# Altium project LightLink_V3.PrjPcb (part 1 of 2)
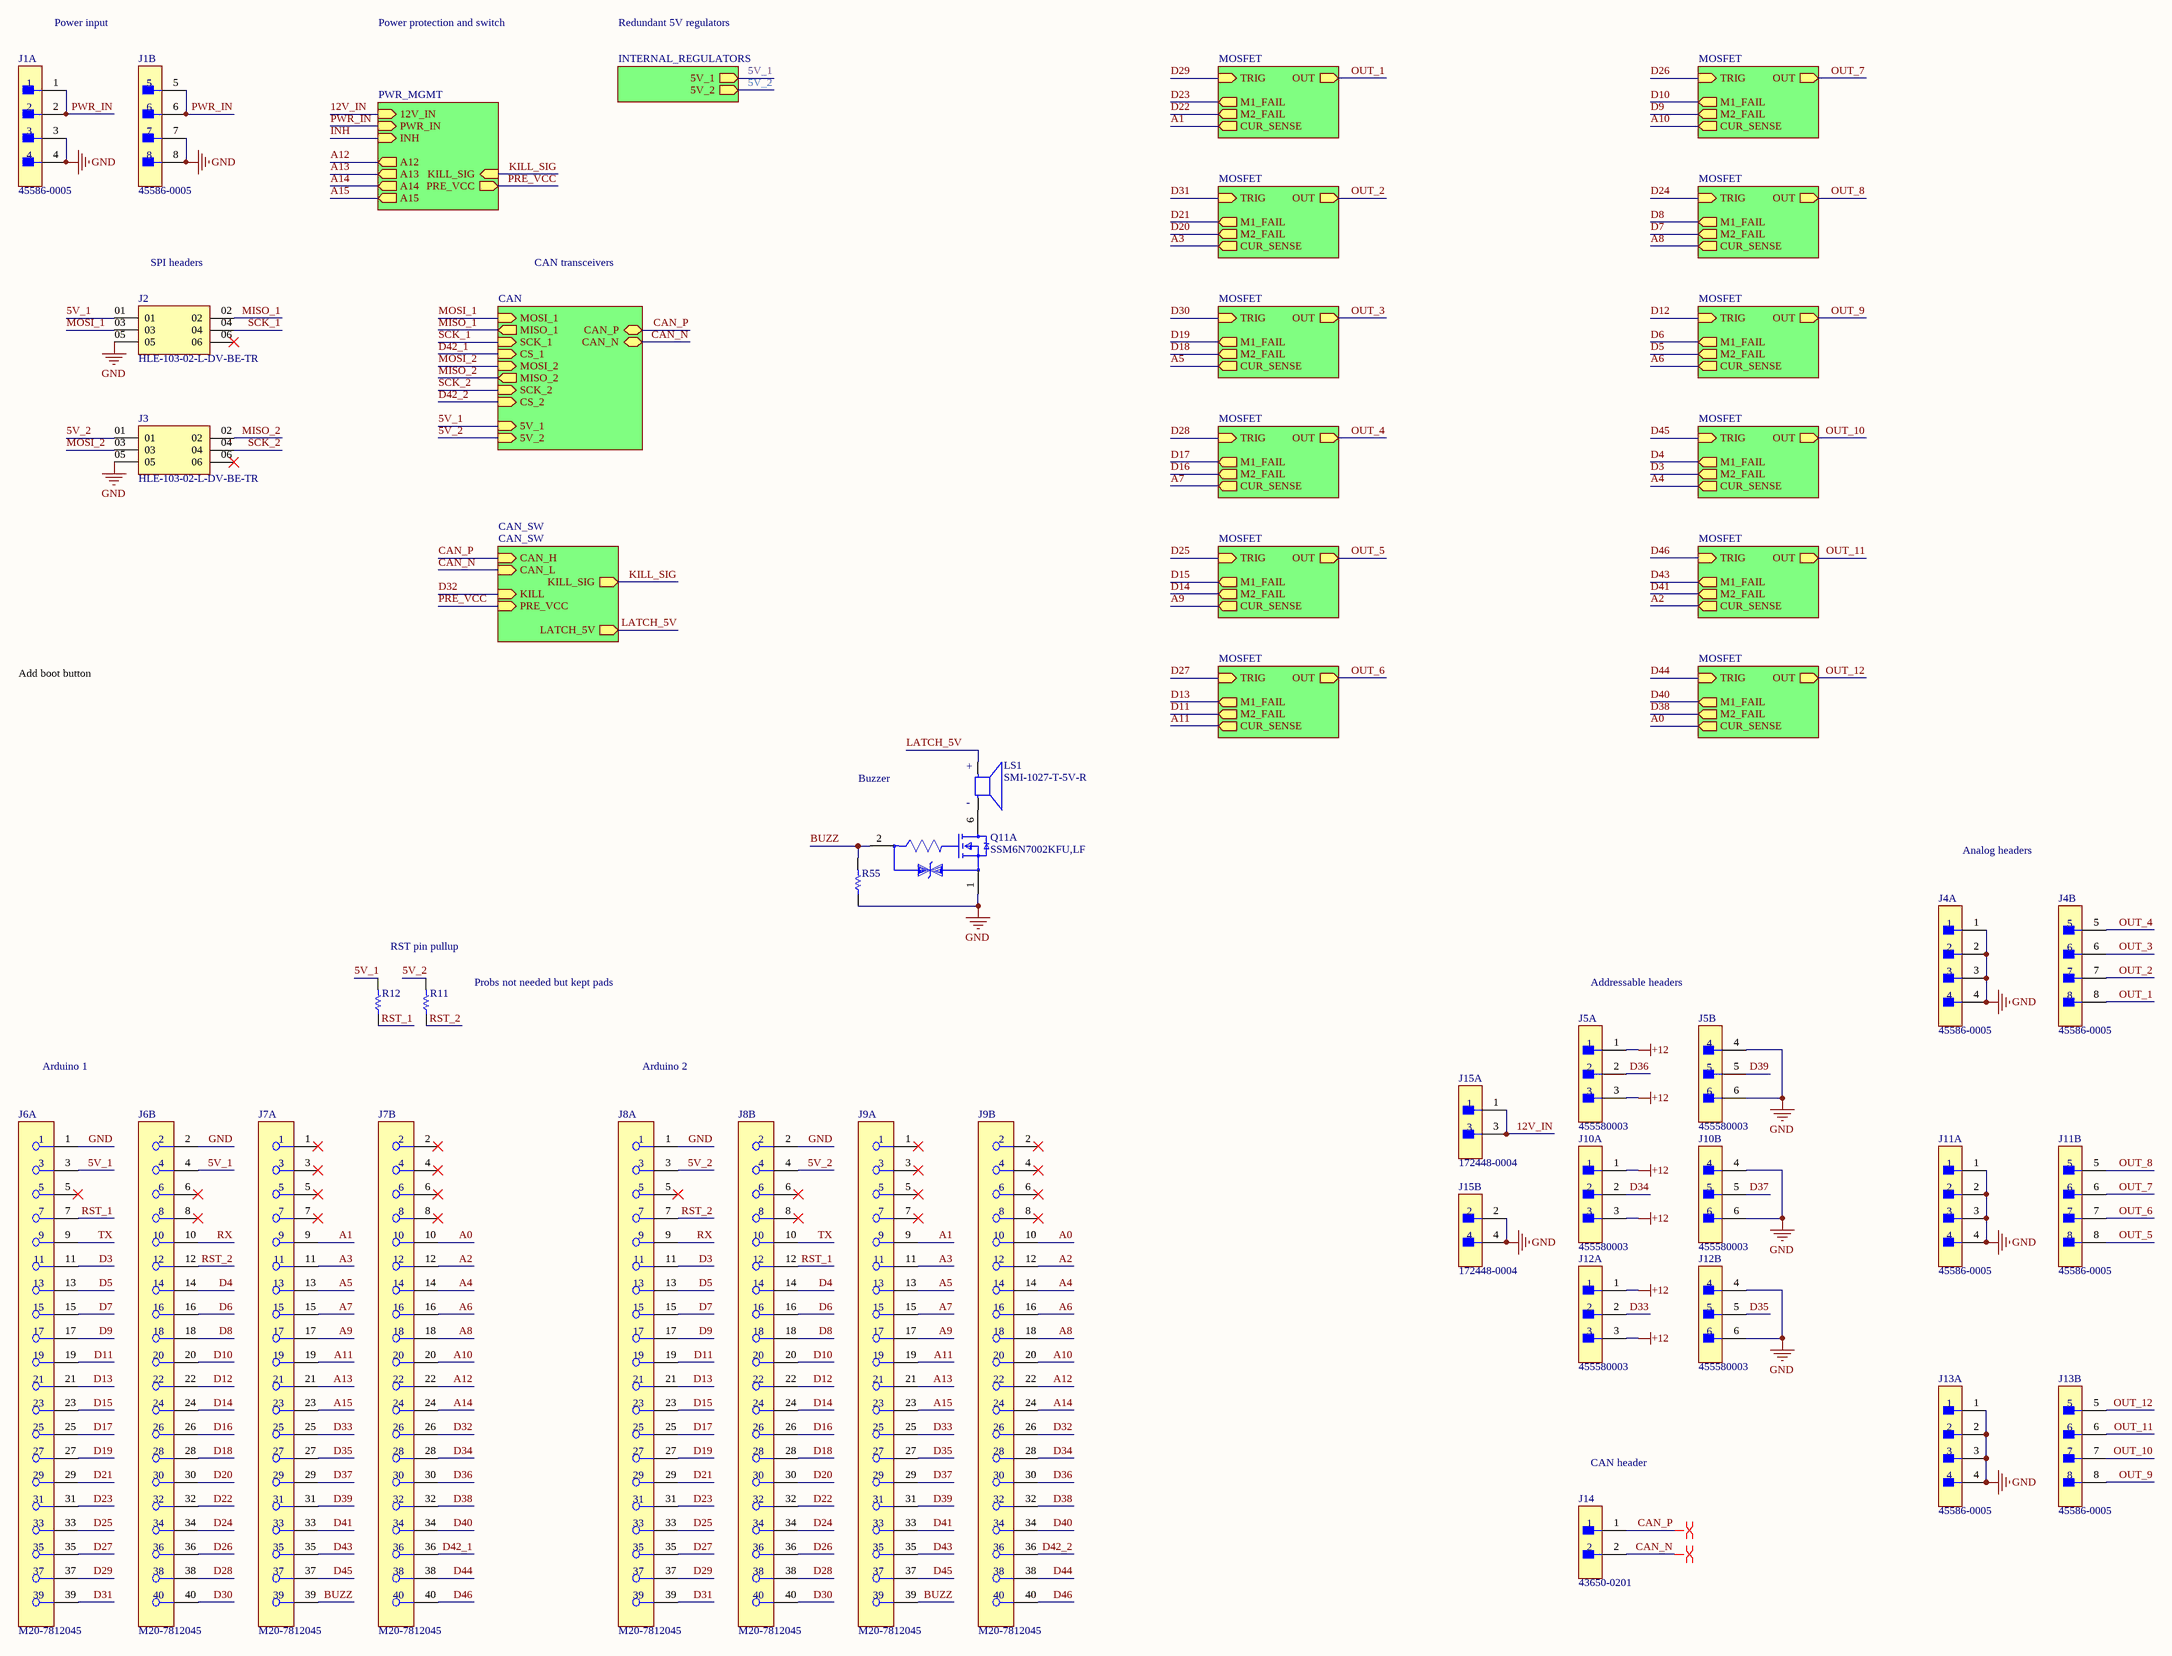
[diagram p0: LightLink_V3.SchDoc]
6 sheets, 429 parts. Net scope: hierarchical (ports join the sheet entries above them; power ports are global).
Board file: LightLink_V3.PcbDoc
Sheets:
  LightLink_V3.SchDoc
    M = MOSFET.SchDoc
    M = MOSFET.SchDoc
    M = MOSFET.SchDoc
    M = MOSFET.SchDoc
    M = MOSFET.SchDoc
    M = MOSFET.SchDoc
    M = MOSFET.SchDoc
    M = MOSFET.SchDoc
    M = MOSFET.SchDoc
    M = MOSFET.SchDoc
    M = MOSFET.SchDoc
    M = MOSFET.SchDoc
    CAN = CAN.SchDoc
    PWR_MGMT = PWR_MGMT.SchDoc
    INTERNAL_REGULATORS = INTERNAL_REGULATORS.SchDoc
    CAN_SW = CAN_SW.SchDoc

## Sheet LightLink_V3.SchDoc
size C; SheetNumber: 1; SheetTotal: 6

### Parts
(Parts that share a designator on the sheet are numbered #1, #2 ... from top to bottom, then left to right.)
J1  45586-0005  [FP-45586-0005-MFG]  (parts A,B of 2)
J2  HLE-103-02-L-DV-BE-TR  [SAMTEC_HLE-103-02-L-DV-BE-TR]
J3  HLE-103-02-L-DV-BE-TR  [SAMTEC_HLE-103-02-L-DV-BE-TR]
J4  45586-0005  [FP-45586-0005-MFG]  (parts A,B of 2)
J5  455580003  [FP-455580003-MFG]  (parts A,B of 2)
J6  M20-7812045  [FP-M20-7812045-MFG]  (parts A,B of 2)
J7  M20-7812045  [FP-M20-7812045-MFG]  (parts A,B of 2)
J8  M20-7812045  [FP-M20-7812045-MFG]  (parts A,B of 2)
J9  M20-7812045  [FP-M20-7812045-MFG]  (parts A,B of 2)
J10  455580003  [FP-455580003-MFG]  (parts A,B of 2)
J11  45586-0005  [FP-45586-0005-MFG]  (parts A,B of 2)
J12  455580003  [FP-455580003-MFG]  (parts A,B of 2)
J13  45586-0005  [FP-45586-0005-MFG]  (parts A,B of 2)
J14  43650-0201  [FP-43650-0201-MFG]
J15  172448-0004  [FP-39-30-1041-MFG]  (parts A,B of 2)
LS1  SMI-1027-T-5V-R  [SMI-1027-T-5V-R-Footprint-1]
Q11#1  SSM6N7002KFU,LF  [FP-SSOP6-P-0_65A-MFG]  (part A of 2)
R11  ERJ3EKF1002V  [RESC1609X55X30LL15T15]  (value not drawn)
R12  ERJ3EKF1002V  [RESC1609X55X30LL15T15]  (value not drawn)
R55  ERJ3EKF1002V  [RESC1609X55X30LL15T15]  (value not drawn)

### Sub-sheets
CAN = CAN: CAN_P (bidir), CAN_N (bidir), CS_1 (in), CS_2 (in), MOSI_1 (in), MISO_1 (out), SCK_1 (in), MOSI_2 (in), MISO_2 (out), SCK_2 (in), 5V_1 (in), 5V_2 (in)
CAN_SW = CAN_SW: CAN_H (in), CAN_L (in), KILL (in), KILL_SIG (out), PRE_VCC (in), LATCH_5V (out)
INTERNAL_REGULATORS = INTERNAL_REGULATORS: 5V_1 (out), 5V_2 (out)
M = MOSFET: TRIG (in), OUT (out), M2_FAIL (out), M1_FAIL (out), CUR_SENSE (out)
M = MOSFET: TRIG (in), OUT (out), M2_FAIL (out), M1_FAIL (out), CUR_SENSE (out)
M = MOSFET: TRIG (in), OUT (out), M2_FAIL (out), M1_FAIL (out), CUR_SENSE (out)
M = MOSFET: TRIG (in), OUT (out), M2_FAIL (out), M1_FAIL (out), CUR_SENSE (out)
M = MOSFET: TRIG (in), OUT (out), M2_FAIL (out), M1_FAIL (out), CUR_SENSE (out)
M = MOSFET: TRIG (in), OUT (out), M2_FAIL (out), M1_FAIL (out), CUR_SENSE (out)
M = MOSFET: TRIG (in), OUT (out), M2_FAIL (out), M1_FAIL (out), CUR_SENSE (out)
M = MOSFET: TRIG (in), OUT (out), M2_FAIL (out), M1_FAIL (out), CUR_SENSE (out)
M = MOSFET: TRIG (in), OUT (out), M2_FAIL (out), M1_FAIL (out), CUR_SENSE (out)
M = MOSFET: TRIG (in), OUT (out), M2_FAIL (out), M1_FAIL (out), CUR_SENSE (out)
M = MOSFET: TRIG (in), OUT (out), M2_FAIL (out), M1_FAIL (out), CUR_SENSE (out)
M = MOSFET: TRIG (in), OUT (out), M2_FAIL (out), M1_FAIL (out), CUR_SENSE (out)
PWR_MGMT = PWR_MGMT: PWR_IN (in), INH (in), A13 (out), A12 (out), PRE_VCC (out), KILL_SIG (in), A14 (out), A15 (out), 12V_IN (in)

### Nets
+12: J5.1 J5.3 J10.1 J10.3 J12.1 J12.3
GND: J1.3 J1.4 J1.7 J1.8 J2.05 J3.05 J4.1 J4.2 J4.3 J4.4 J5.4 J5.6 J6.1 J6.2 J8.1 J8.2 J10.4 J10.6 J11.1 J11.2 J11.3 J11.4 J12.4 J12.6 J13.1 J13.2 J13.3 J13.4 J15.2 J15.4 Q11#1.1(Source1) R55.1
5V_1: J2.01 J6.3 J6.4 R12.2 ; sheet CAN/5V_1, sheet INTERNAL_REGULATORS/5V_1
5V_2: J3.01 J8.3 J8.4 R11.2 ; sheet CAN/5V_2, sheet INTERNAL_REGULATORS/5V_2
12V_IN: J15.1 J15.3 ; sheet PWR_MGMT/12V_IN
A0: J7.10 J9.10 ; sheet M/CUR_SENSE
A1: J7.9 J9.9 ; sheet M/CUR_SENSE
A2: J7.12 J9.12 ; sheet M/CUR_SENSE
A3: J7.11 J9.11 ; sheet M/CUR_SENSE
A4: J7.14 J9.14 ; sheet M/CUR_SENSE
A5: J7.13 J9.13 ; sheet M/CUR_SENSE
A6: J7.16 J9.16 ; sheet M/CUR_SENSE
A7: J7.15 J9.15 ; sheet M/CUR_SENSE
A8: J7.18 J9.18 ; sheet M/CUR_SENSE
A9: J7.17 J9.17 ; sheet M/CUR_SENSE
A10: J7.20 J9.20 ; sheet M/CUR_SENSE
A11: J7.19 J9.19 ; sheet M/CUR_SENSE
A12: J7.22 J9.22 ; sheet PWR_MGMT/A12
A13: J7.21 J9.21 ; sheet PWR_MGMT/A13
A14: J7.24 J9.24 ; sheet PWR_MGMT/A14
A15: J7.23 J9.23 ; sheet PWR_MGMT/A15
BUZZ: J7.39 J9.39 Q11#1.2(Gate1) R55.2
CAN_N: J14.2 ; sheet CAN/CAN_N, sheet CAN_SW/CAN_L
CAN_P: J14.1 ; sheet CAN/CAN_P, sheet CAN_SW/CAN_H
D3: J6.11 J8.11 ; sheet M/M2_FAIL
D4: J6.14 J8.14 ; sheet M/M1_FAIL
D5: J6.13 J8.13 ; sheet M/M2_FAIL
D6: J6.16 J8.16 ; sheet M/M1_FAIL
D7: J6.15 J8.15 ; sheet M/M2_FAIL
D8: J6.18 J8.18 ; sheet M/M1_FAIL
D9: J6.17 J8.17 ; sheet M/M2_FAIL
D10: J6.20 J8.20 ; sheet M/M1_FAIL
D11: J6.19 J8.19 ; sheet M/M2_FAIL
D12: J6.22 J8.22 ; sheet M/TRIG
D13: J6.21 J8.21 ; sheet M/M1_FAIL
D14: J6.24 J8.24 ; sheet M/M2_FAIL
D15: J6.23 J8.23 ; sheet M/M1_FAIL
D16: J6.26 J8.26 ; sheet M/M2_FAIL
D17: J6.25 J8.25 ; sheet M/M1_FAIL
D18: J6.28 J8.28 ; sheet M/M2_FAIL
D19: J6.27 J8.27 ; sheet M/M1_FAIL
D20: J6.30 J8.30 ; sheet M/M2_FAIL
D21: J6.29 J8.29 ; sheet M/M1_FAIL
D22: J6.32 J8.32 ; sheet M/M2_FAIL
D23: J6.31 J8.31 ; sheet M/M1_FAIL
D24: J6.34 J8.34 ; sheet M/TRIG
D25: J6.33 J8.33 ; sheet M/TRIG
D26: J6.36 J8.36 ; sheet M/TRIG
D27: J6.35 J8.35 ; sheet M/TRIG
D28: J6.38 J8.38 ; sheet M/TRIG
D29: J6.37 J8.37 ; sheet M/TRIG
D30: J6.40 J8.40 ; sheet M/TRIG
D31: J6.39 J8.39 ; sheet M/TRIG
D32: J7.26 J9.26 ; sheet CAN_SW/KILL
D33: J7.25 J9.25 J12.2
D34: J7.28 J9.28 J10.2
D35: J7.27 J9.27 J12.5
D36: J5.2 J7.30 J9.30
D37: J7.29 J9.29 J10.5
D38: J7.32 J9.32 ; sheet M/M2_FAIL
D39: J5.5 J7.31 J9.31
D40: J7.34 J9.34 ; sheet M/M1_FAIL
D41: J7.33 J9.33 ; sheet M/M2_FAIL
D42_1: J7.36 ; sheet CAN/CS_1  [project net CS_1]
D42_2: J9.36 ; sheet CAN/CS_2  [project net CS_2]
D43: J7.35 J9.35 ; sheet M/M1_FAIL
D44: J7.38 J9.38 ; sheet M/TRIG
D45: J7.37 J9.37 ; sheet M/TRIG
D46: J7.40 J9.40 ; sheet M/TRIG
INH: sheet PWR_MGMT/INH
KILL_SIG: sheet PWR_MGMT/KILL_SIG, sheet CAN_SW/KILL_SIG
LATCH_5V: LS1.LOAD+(POS) ; sheet CAN_SW/LATCH_5V
MISO_1: J2.02 ; sheet CAN/MISO_1
MISO_2: J3.02 ; sheet CAN/MISO_2
MOSI_1: J2.03 ; sheet CAN/MOSI_1
MOSI_2: J3.03 ; sheet CAN/MOSI_2
OUT_1: J4.8 ; sheet M/OUT
OUT_2: J4.7 ; sheet M/OUT
OUT_3: J4.6 ; sheet M/OUT
OUT_4: J4.5 ; sheet M/OUT
OUT_5: J11.8 ; sheet M/OUT
OUT_6: J11.7 ; sheet M/OUT
OUT_7: J11.6 ; sheet M/OUT
OUT_8: J11.5 ; sheet M/OUT
OUT_9: J13.8 ; sheet M/OUT
OUT_10: J13.7 ; sheet M/OUT
OUT_11: J13.6 ; sheet M/OUT
OUT_12: J13.5 ; sheet M/OUT
PRE_VCC: sheet PWR_MGMT/PRE_VCC, sheet CAN_SW/PRE_VCC
PWR_IN: J1.1 J1.2 J1.5 J1.6 ; sheet PWR_MGMT/PWR_IN
RST_1: J6.7 J8.12 R12.1
RST_2: J6.12 J8.7 R11.1
RX: J6.10 J8.9
SCK_1: J2.04 ; sheet CAN/SCK_1
SCK_2: J3.04 ; sheet CAN/SCK_2
TX: J6.9 J8.10
NetLS1_LOAD-: LS1.LOAD-(NEG) Q11#1.6(Drain1)

Not connected (* = marked no-connect by the designer): J2 06*; J3 06*; J6 5* 6* 8*; J7 1* 2* 3* 4* 5* 6* 7* 8*; J8 5* 6* 8*; J9 1* 2* 3* 4* 5* 6* 7* 8*

### Layout directives
differential pair: CAN_N, CAN_P

### Notes on the sheet
- Power input
- Power protection and switch
- Redundant 5V regulators
- SPI headers
- CAN transceivers
- Add boot button
- Buzzer
- Analog headers
- RST pin pullup
- Probs not needed but kept pads
- Addressable headers
- Arduino 1
- Arduino 2
- CAN header
- (in symbol CMP-00027-00002-1) +; -

### Library data of the parts
J1 J4 J11 J13 = CMP-04776-000690-1: CONN HEADER R/A 8POS 4.2MM
J2 J3 = CMP-020-000000-4: MF: Samtec; Availability: Unavailable; Package: None; Component Type: Standard; MP: HLE-103-02-L-DV-BE-TR; Pin Count: 6; Design Item ID: HLE-103-02-L-DV-BE-TR; Value: *; Price: None; Source: HLE-103-02-L-DV-BE-TR.SchLib
J5 J10 J12 = CMP-04776-000024-1: CONN HEADER R/A 6POS 4.2MM; Manufacturer: Molex; Standoff Height: 0.4mm; Conn Orientation: Right Angle; Number Of Contacts: 6; Conn Gender: Male; Voltage Rating: 600V; Current Rating: 8A; Footprint Url: https://www.molex.com/pdm_docs/sd/455580003_sd.pdf; Number Of Rows: 2; Lead Free: Yes; Digikey Description: CONN HEADER R/A 6POS 4.2MM; ComponentLink2URL: https://www.molex.com/webdocs/datasheets/pdf/en-us/0455580003_PCB_HEADERS.pdf; Octopart: https://octopart.com/45558-0003-molex-7672845; Package: 0; Device Class L3: unset; ComponentLink2Description: Datasheet; Device Class L2: Headers and Wire Housings; Category: Conn; Contact Material: Tin,Nickel; Mouser Description: Conn Power HDR 6 POS 4.2mm Solder ST Thru-Hole 6 Terminal 1 Port Mini-Fit Jr™ Tray; Manufacturer Part Number: 455580003; Pitch: 4.2mm; Device Class L1: Connectors; Temperature Range Low: -40°C; Temperature: -40°C to +105°C; RoHS: TRUE; Temperature Range High: +105°C; Height: 10.38mm; Automotive: No
J6-J9 = CMP-15831-000026-1: CONN RCPT 40POS 0.1 GOLD SMD; Current Rating: 3A; Number of Positions: 40; Connector Type: Receptacle; Max Operating Temperature: 105°C; Flammability Rating: UL94 V-0; Contact Material: Bronze; Number of Rows: 2; Fastening Type: Push; Insulation Color: Black; Mount: Surface Mount; Contact Shape: Square; Termination: Solder; Packaging: Rail/Tube; Contact Plating: Gold; Min Operating Temperature: -40°C; Insulation Material: Nylon
J14 = CMP-04776-000557-1: CONN HEADER R/A 2POS 3MM; Voltage Rating: 600V; Number of Circuits: 2; Insulation Resistance: 1GR; Current Rating: 5A; Voltage Rating (DC): 250V; Contact Resistance: 10mR; Gender: Male; Number of Ports: 1; Glow Wire Compliant: Compliant; Pitch: 3mm; Contact Plating: Gold; Series: 43650; Color: Black; Max Operating Temperature: 105°C; Radiation Hardening: No; Orientation: Right Angle; Number of Terminals/Pins: 2; Length: 9.65mm; Case/Package: 0201; Halogen Free: Low Halogen; Housing Color: Black; Min Operating Temperature: -40°C; Package Quantity: 3927; Contact Material: Brass; Number of Rows: 1; Number of Positions: 2; Termination: Solder; Depth: 9.9mm; Mount: Through Hole; Packaging: Tray; Number of Contacts: 2; Housing Material: Thermoplastic; Flammability Rating: UL94 V-0
J15 = CMP-04776-000047-1: Different component but holes should line up. Original P/N is 39-30-1041; Manufacturer: Molex; Old_Part_Number: 5569-04A2G; Keying_to_Mating_Part: None; Circuits_maximum: 4; First_Mate__Last_Break: No; Lead_freeProcess_Capability: WAVE; Duration_at_Max_Process_Temperature_seconds: 005; Sales_Drawing: SDA-5569-NA2*-*; Current Rating: 13A; Material___Plating_Mating: Gold; Conn Gender: Male; Test_Summary: TS-5556-002; Color___Resin: Natural; Termination_Interface_Style: Through Hole; Pitch___Termination_Interface: 4.20mm; UL: E29179; PCB_Retention: Yes; Product_Name: Mini-Fit Jr.TM; Material___Resin: Nylon; Overview: Mini-Fit Jr. Power Connectors; CSA: LR19980; Plating_min___Termination: 2.540μm; Packaging_Type: Bag; Number_of_Rows: 2; Durability_mating_cycles_max: 30; Max_Cycles_at_Max_Process_Temperature: 001; Product_Specification: PS-45750-001, PS-5556-001; Net_Weight: 1.529/g; Voltage___Maximum: 600V; Material___Metal: Brass; Pitch: 4.2mm; Packaging_Specification: PK-5569-002; Shrouded: Fully; Plating_min___Mating: 0.762μm; Temperature_Range___Operating: -40°C to +105°C; Current___Maximum_per_Contact: 13.0A; Comments: Current = 13A max. per circuit when header is mated to a receptacle loaded with  45750  Mini-Fit® Plus HCS Crimp Terminal Crimped to 16 AWG wire.,  See Molex Product specification PS-5556-001 for additional current de-rating information.; Process_Temperature_max_C: 240; PCB_Thickness___Recommended: 1.78mm; Standoff Height: 0.016inch; Surface_Mount_Compatible_SMC: No; UPC: 800753579651; Conn Orientation: Right Angle; Material___Plating_Termination: Matte Tin; ComponentLink2Description: Datasheet; Footprint Url: https://www.molex.com/pdm_docs/sd/039301041_sd.pdf; Contact Material: Gold,Nickel; Octopart: https://octopart.com/39-30-1041-molex-276737; Digikey Description: CONN HEADER R/A 4POS 4.2MM; imported: yes; Series: 5569; Mouser Description: Headers & Wire Housings 4 CKT R/A HEADER; Temperature Range High: +105°C; Category: Conn; Polarized_to_Mating_Part: Yes; Pitch___Mating_Interface: 4.20mm; Automotive: No; Guide_to_Mating_Part: No; Lock_to_Mating_Part: Yes; Number Of Contacts: 4; Temperature Range Low: -40°C; RoHS: TRUE; Status: Active; imported_from: 3D Model; ComponentLink2URL: http://www.molex.com/pdm_docs/sd/039301041_sd.pdf; part_page: http://www.molex.com/molex/products/datasheet.jsp?part=active/0039301041_PCB_HEADERS.xml; Temperature: -40°C to +105°C; Device Class L3: unset; Device Class L1: Connectors; Package: 39-30-1041; Circuits_Loaded: 4; Lead Free: Yes; Ipc Land Pattern Name: CAPAD1016W80L630D240; Application: Power, Wire-to-Board; Voltage Rating: 600V; Manufacturer Part Number: 39-30-1041; Breakaway: No; Orientation: Right Angle; Flammability: 94V-2; 3D_model: http://www.molex.com/pdm_docs/stp/39-30-1041_stp.zip; Number Of Rows: 2; Polarized_to_PCB: Yes; Device Class L2: Headers and Wire Housings; Glow_Wire_Compliant: No; Stackable: No; PCB_Locator: Yes
LS1 = CMP-00027-00002-1: Audio Ind Magnt 5V 9.6X9.6MM SMD
Q11#1 = CMP-35916-000009-1: MOSFET 2N-CH 60V 0.3A; Input Capacitance: 40pF; Continuous Drain Current (ID): 300mA; Max Power Dissipation: 285mW; FET Type: 2 N-Channel; Rds On Max: 1.5R; Mount: Surface Mount; Drain to Source Voltage (Vdss): 60V; Packaging: Tape and Reel
R11 R12 R55 = CMP-1012-00623-3: Chip Resistor, 10 KOhm, +/- 1%, 0.1 W, -55 to 155 degC, 0603 (1608 Metric), RoHS, Tape and Reel; Manufacturer: Panasonic; Voltage Rating: 75V; Case\/Package: 0603; Power Rating: 100mW; Resistance: 10KOhm; Temperature Coefficient: 100ppm\/degreesC; Number of Pins: 2; Package Reference: 603; Depth: 0.8mm; Mount: SurfaceMount; Package Description: 2-Pin Surface Mount Device, Body 1.6 x 0.85 mm; Datasheet Version: 02/2017; Length: 1.6mm; Lead Free: LeadFree; Height: 0.45mm; Number of Terminations: 2; Max Power Dissipation: 100mW; Min Operating Temperature: -55degC; Datasheet URL: https://industrial.panasonic.com/cdbs/www-data/pdf/RDA0000/AOA0000C304.pdf; Termination: SMD/SMT; Case Code (Metric): 1608; Case Code (Imperial): 0603; Tolerance: 1%; Max Operating Temperature: 155degC; RoHSCompliant: true; Voltage Rating (DC): 75V; Radiation Hardening: No; Packaging: TapeandReel; Composition: ThickFilm; Mounting Technology: SurfaceMount; Manufacturer URL: http://www.panasonic.com/; Width: 0.031inch; REACH SVHC: NoSVHC; Contact Plating: Tin; Military Standard: Not; Package Quantity: 1

## Sheet MOSFET.SchDoc
size B; SheetNumber: 2; SheetTotal: 6
Used 12 times, as channels M, M, M, M, M, M, M, M, M, M, M, M. Parts and nets are listed once, with the designators drawn on the sheet.
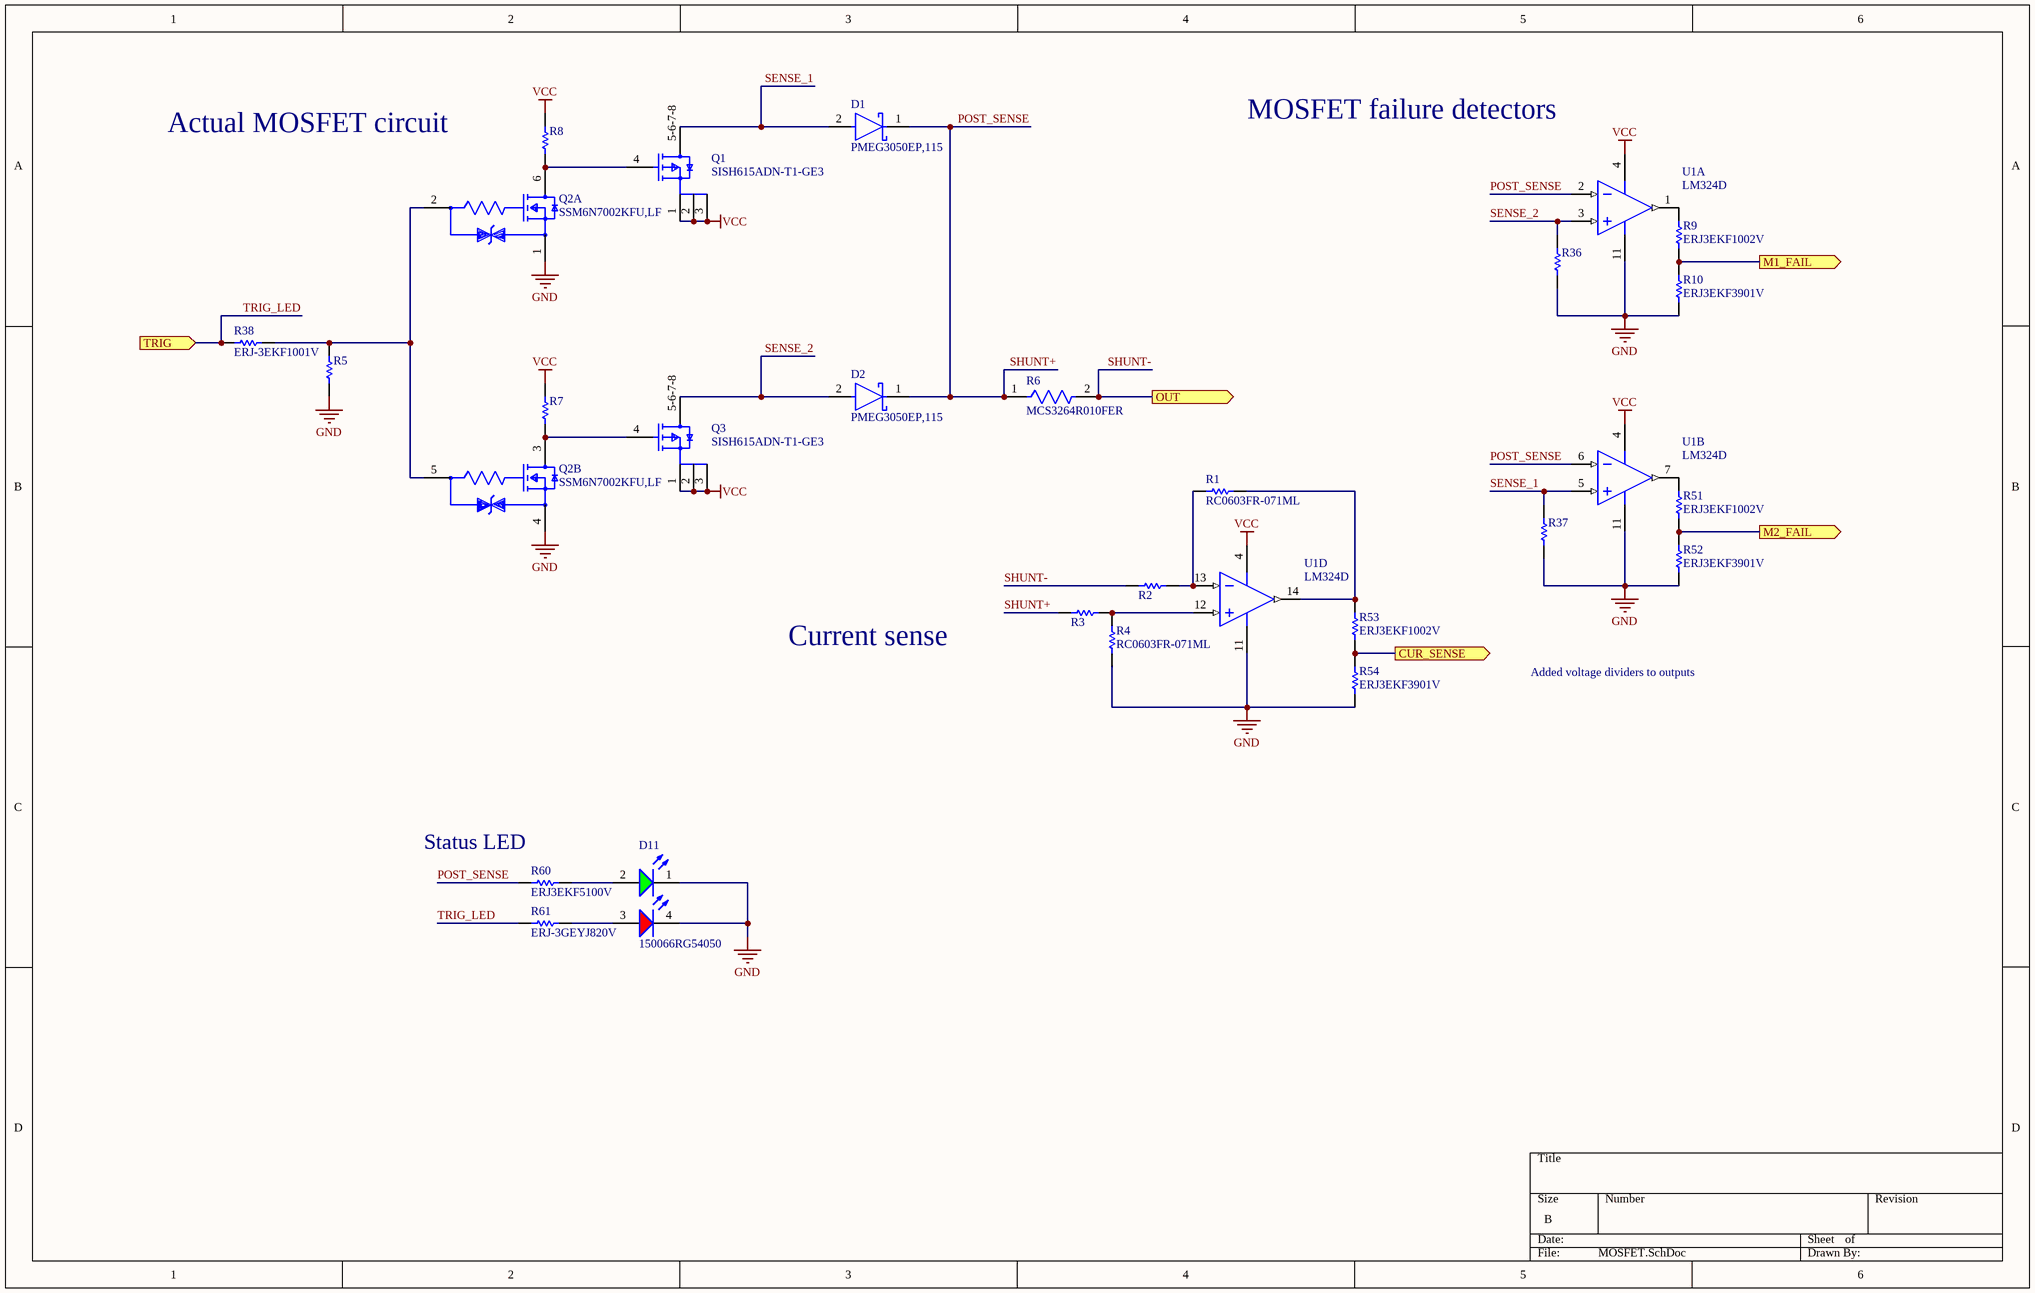
[diagram p1: MOSFET.SchDoc]

### Parts
D1  PMEG3050EP,115  [FP-SOD128-MFG]
D2  PMEG3050EP,115  [FP-SOD128-MFG]
D11  150066RG54050  [WL-SBCD_0606]
Q1  SISH615ADN-T1-GE3  [SISH615ADN-T1-GE3-Footprint-1]
Q2  SSM6N7002KFU,LF  [FP-SSOP6-P-0_65A-MFG]  (parts A,B of 2)
Q3  SISH615ADN-T1-GE3  [SISH615ADN-T1-GE3-Footprint-1]
R1  RC0603FR-071ML  [RESC1608X55X25LL10T15]
R2  ERJ3EKF1002V  [RESC1609X55X30LL15T15]  (value not drawn)
R3  ERJ3EKF1002V  [RESC1609X55X30LL15T15]  (value not drawn)
R4  RC0603FR-071ML  [RESC1608X55X25LL10T15]
R5  ERJ3EKF1002V  [RESC1609X55X30LL15T15]  (value not drawn)
R6  MCS3264R010FER  [FP-MCS3264-MFG]
R7  ERJ3EKF1002V  [RESC1609X55X30LL15T15]  (value not drawn)
R8  ERJ3EKF1002V  [RESC1609X55X30LL15T15]  (value not drawn)
R9  ERJ3EKF1002V  [RESC1609X55X30LL15T15]
R10  ERJ3EKF3901V  [RESC1608X55X30ML15T15]
R36  ERJ-3EKF1003V  [RESC1608X55X30ML15T15]  (value not drawn)
R37  ERJ-3EKF1003V  [RESC1608X55X30ML15T15]  (value not drawn)
R38  ERJ-3EKF1001V  [RESC1608X55X30LL15T15]
R51  ERJ3EKF1002V  [RESC1609X55X30LL15T15]
R52  ERJ3EKF3901V  [RESC1608X55X30ML15T15]
R53  ERJ3EKF1002V  [RESC1609X55X30LL15T15]
R54  ERJ3EKF3901V  [RESC1608X55X30ML15T15]
R60  ERJ3EKF5100V  [RESC1608X55X30NL15T15]
R61  ERJ-3GEYJ820V  [RESC1608X55X30NL15T15]
U1  LM324D  [D0014A_L]  (parts A,B,D of 4)

### Ports
CUR_SENSE (out, see LightLink_V3[5A]), M1_FAIL (out, see LightLink_V3[5A]), M2_FAIL (out, see LightLink_V3[5A]), OUT (out, see LightLink_V3[5A]), TRIG (in, see LightLink_V3[5A])

### Nets
GND: D11.1(K) D11.4(K) Q2.1(Source1) Q2.4(Source2) R4.1 R5.1 R10.1 R36.1 R37.1 R52.1 R54.1 U1.11(GND)
VCC: Q1.1(S) Q1.2(S) Q1.3(S) Q3.1(S) Q3.2(S) Q3.3(S) R7.2 R8.2 U1.4(VCC)
CUR_SENSE: R53.1 R54.2 ; port CUR_SENSE
M1_FAIL: R9.1 R10.2 ; port M1_FAIL
M2_FAIL: R51.1 R52.2 ; port M2_FAIL
POST_SENSE: D1.1(C) D2.1(C) R3.2 R6.1 R60.1 U1.2(1IN-) U1.6(2IN-)  [also labelled SHUNT+]
SENSE_1: D1.2(A) Q1.5-6-7-8(D) R37.2 U1.5(2IN+)
SENSE_2: D2.2(A) Q3.5-6-7-8(D) R36.2 U1.3(1IN+)
SHUNT-: R2.2 R6.2 ; port OUT
TRIG_LED: R38.1 R61.1 ; port TRIG
NetD11_2: D11.2(A) R60.2
NetD11_3: D11.3(A) R61.2
NetQ1_4: Q1.4(G) Q2.6(Drain1) R8.1
NetQ2_2: Q2.2(Gate1) Q2.5(Gate2) R5.2 R38.2
NetQ2_3: Q2.3(Drain2) Q3.4(G) R7.1
NetR1_1: R1.1 R2.1 U1.13(4IN-)
NetR1_2: R1.2 R53.2 U1.14(4OUT)
NetR3_1: R3.1 R4.2 U1.12(4IN+)
NetR9_2: R9.2 U1.1(1OUT)
NetR51_2: R51.2 U1.7(2OUT)

### Channels
M: designators end in _M#1; ports CUR_SENSE=A1 M1_FAIL=D23 M2_FAIL=D22 OUT=OUT_1 TRIG=D29
M: designators end in _M#2; ports CUR_SENSE=A3 M1_FAIL=D21 M2_FAIL=D20 OUT=OUT_2 TRIG=D31
M: designators end in _M#3; ports CUR_SENSE=A5 M1_FAIL=D19 M2_FAIL=D18 OUT=OUT_3 TRIG=D30
M: designators end in _M#4; ports CUR_SENSE=A7 M1_FAIL=D17 M2_FAIL=D16 OUT=OUT_4 TRIG=D28
M: designators end in _M#5; ports CUR_SENSE=A9 M1_FAIL=D15 M2_FAIL=D14 OUT=OUT_5 TRIG=D25
M: designators end in _M#6; ports CUR_SENSE=A11 M1_FAIL=D13 M2_FAIL=D11 OUT=OUT_6 TRIG=D27
M: designators end in _M#7; ports CUR_SENSE=A10 M1_FAIL=D10 M2_FAIL=D9 OUT=OUT_7 TRIG=D26
M: designators end in _M#8; ports CUR_SENSE=A8 M1_FAIL=D8 M2_FAIL=D7 OUT=OUT_8 TRIG=D24
M: designators end in _M#9; ports CUR_SENSE=A6 M1_FAIL=D6 M2_FAIL=D5 OUT=OUT_9 TRIG=D12
M: designators end in _M#10; ports CUR_SENSE=A4 M1_FAIL=D4 M2_FAIL=D3 OUT=OUT_10 TRIG=D45
M: designators end in _M#11; ports CUR_SENSE=A2 M1_FAIL=D43 M2_FAIL=D41 OUT=OUT_11 TRIG=D46
M: designators end in _M#12; ports CUR_SENSE=A0 M1_FAIL=D40 M2_FAIL=D38 OUT=OUT_12 TRIG=D44

### Notes on the sheet
- Actual MOSFET circuit
- MOSFET failure detectors
- Current sense
- Added voltage dividers to outputs
- (near R60) Status LED

### Library data of the parts
D1 D2 = CMP-14398-000051-1: DIODE SCHOTTKY 30V 5A SOD128; RoHS Compliant: Yes
D11 = CMP-004-00034-2: Led, Red/Grn, 180Mcd/230Mcd, 624Nm/525Nm Rohs Compliant: Yes
Q1 Q3 = CMP-013-00036-2: Trans MOSFET P-CH 20V 22.1A 8-Pin PowerPAK 1212 EP T/R
Q2 = CMP-35916-000009-1: as Q11#1 on sheet LightLink_V3; Mount: Surface Mount; Drain to Source Voltage (Vdss): 60V; Packaging: Tape and Reel
R1 R4 = CMP-1659-00056-1: Chip Resistor, 1 MOhm, +/- 1%, 100 mW, -55 to 155 degC, 0603 (1608 Metric), RoHS, Tape and Reel; Voltage Rating (DC): 25 V; Tolerance: 20%; Case\Package: Radial; Capacitance: 1 mF; Min Operating Temperature: -40 degC; PackageDescription: 2-Pin Surface Mount Device, Body 1.6 x 0.8 mm; ComponentLink1Description: Manufacturer URL; Radiation Hardening: No; DatasheetVersion: Rev. 4, 02/2016; REACH SVHC: No SVHC; Length: 20 mm; Max Operating Temperature: 85 degC; Diameter: 10 mm; Packaging: Bulk; Package Quantity: 200; PackageReference: 0603; Mount: Through Hole; ComponentLink1URL: http://www.yageo.com/; ComponentLink2URL: http://www.yageo.com/documents/recent/PYu-RC_Group_51_RoHS_L_04.pdf; ComponentLink2Description: Datasheet; Width: 0 inch; Lead Pitch: 5 mm; RoHSCompliant: true; Voltage Rating: 25 V; Height: 20 mm
R2 R3 R5 R7-R9 R51 R53 = CMP-1012-00623-3: as R11 on sheet LightLink_V3; Number of Pins: 2; Package Reference: 603; Depth: 0.8mm; Mount: SurfaceMount; Package Description: 2-Pin Surface Mount Device, Body 1.6 x 0.85 mm; Datasheet Version: 02/2017; Length: 1.6mm; Lead Free: LeadFree; Height: 0.45mm; Number of Terminations: 2; Max Power Dissipation: 100mW; Min Operating Temperature: -55degC; Datasheet URL: https://industrial.panasonic.com/cdbs/www-data/pdf/RDA0000/AOA0000C304.pdf; Termination: SMD/SMT; Case Code (Metric): 1608; Case Code (Imperial): 0603; Tolerance: 1%; Max Operating Temperature: 155degC; RoHSCompliant: true; Voltage Rating (DC): 75V; Radiation Hardening: No; Packaging: TapeandReel; Composition: ThickFilm; Mounting Technology: SurfaceMount; Manufacturer URL: http://www.panasonic.com/; Width: 0.031inch; REACH SVHC: NoSVHC; Contact Plating: Tin; Military Standard: Not; Package Quantity: 1
R6 = CMP-33361-000012-1: RES SMD 10 MOHM 1% 2W 3264; Temperature Coefficient: 50ppm/°C; Resistance: 10mR; Voltage Rating: 220mV; Case/Package: 2512; Military Standard: Not; Max Operating Temperature: 150°C; Height: 0.024inch; Package Quantity: 1; Case Code (Imperial): 2512; Number of Terminations: 2; Features: Flame Retardant Coating; Width: 0.126inch; Tolerance: 1%; Composition: Metal Element; Number of Pins: 2; Packaging: Tape and Reel; Depth: 3.2mm; Termination: SMD/SMT; Min Operating Temperature: -55°C; Power Rating: 2W; Case Code (Metric): 6432; Max Power Dissipation: 2W; Mount: Surface Mount; Length: 6.4mm
R10 R52 R54 = CMP-2000-00475-1: Manufacturer: Panasonic; Part Number: ERJ3EKF3901V
R36 R37 = CMP-2000-00182-1: Manufacturer: Panasonic; Part Number: ERJ-3EKF1003V
R38 = CMP-2000-00180-1: Manufacturer: Panasonic; Part Number: ERJ-3EKF1001V
R60 = CMP-2000-00539-1: Manufacturer: Panasonic; Part Number: ERJ3EKF5100V
R61 = CMP-1012-00048-2: Manufacturer: Panasonic; Part Number: ERJ-3GEYJ820V
U1 = CMP-2000-06547-1: Quadruple Operational Amplifier, 0.5 V/us, 1.2 MHz, 3 to 32 V, 0 to 70 degC, 14-Pin SOIC (D), Green (RoHS & no Sb/Br), Tube; Manufacturer: Texas Instruments; Unity Gain Bandwidth Product: 1.2MHz; Input Offset Voltage: 7mV; Dual Supply Voltage (Max): ±16V; Single Supply Voltage (Min): 3V; Single Supply Voltage (Max): 32V; Voltage Gain in dB: 100dB; Power Supply Requirement: Single/Dual; Input Bias Current: 250nA; Dual Supply Voltage (Min): ±1.5V; Single Supply Voltage (Typ): 5/9/12/15/18/24/28V; Dual Supply Voltage (Typ): ±3/±5/±9/±12/±15V; Number of  Elements: 4; Common Mode Rejection Ratio: 65dB; Datasheet Version: Rev. W, 03/2015; Technology: Bipolar; Shut Down Feature: No; Package Reference: D0014A; Type: GeneralPurposeAmplifier; Pin Count: 14; Package Type: SOIC; Rail/Rail I/O Type: No; Manufacturer URL: http://www.ti.com/; Package Description: 14-Pin Small Outline Integrated Circuit, Body 8.65 x 3.9 mm, Pitch 1.27 mm; Operating Temperature Classification: Commercial; Datasheet URL: http://www.ti.com/lit/ds/symlink/lm324.pdf; Slew Rate: 0.5V/us; Package URL: http://www.ti.com/lit/ml/mpds177g/mpds177g.pdf; Mounting: SurfaceMount; Packaging: Rail/Tube; Mounting Technology: SurfaceMount; Operating Temp Range: 0Cto70C

## Sheet CAN.SchDoc
size B; SheetNumber: 3; SheetTotal: 6
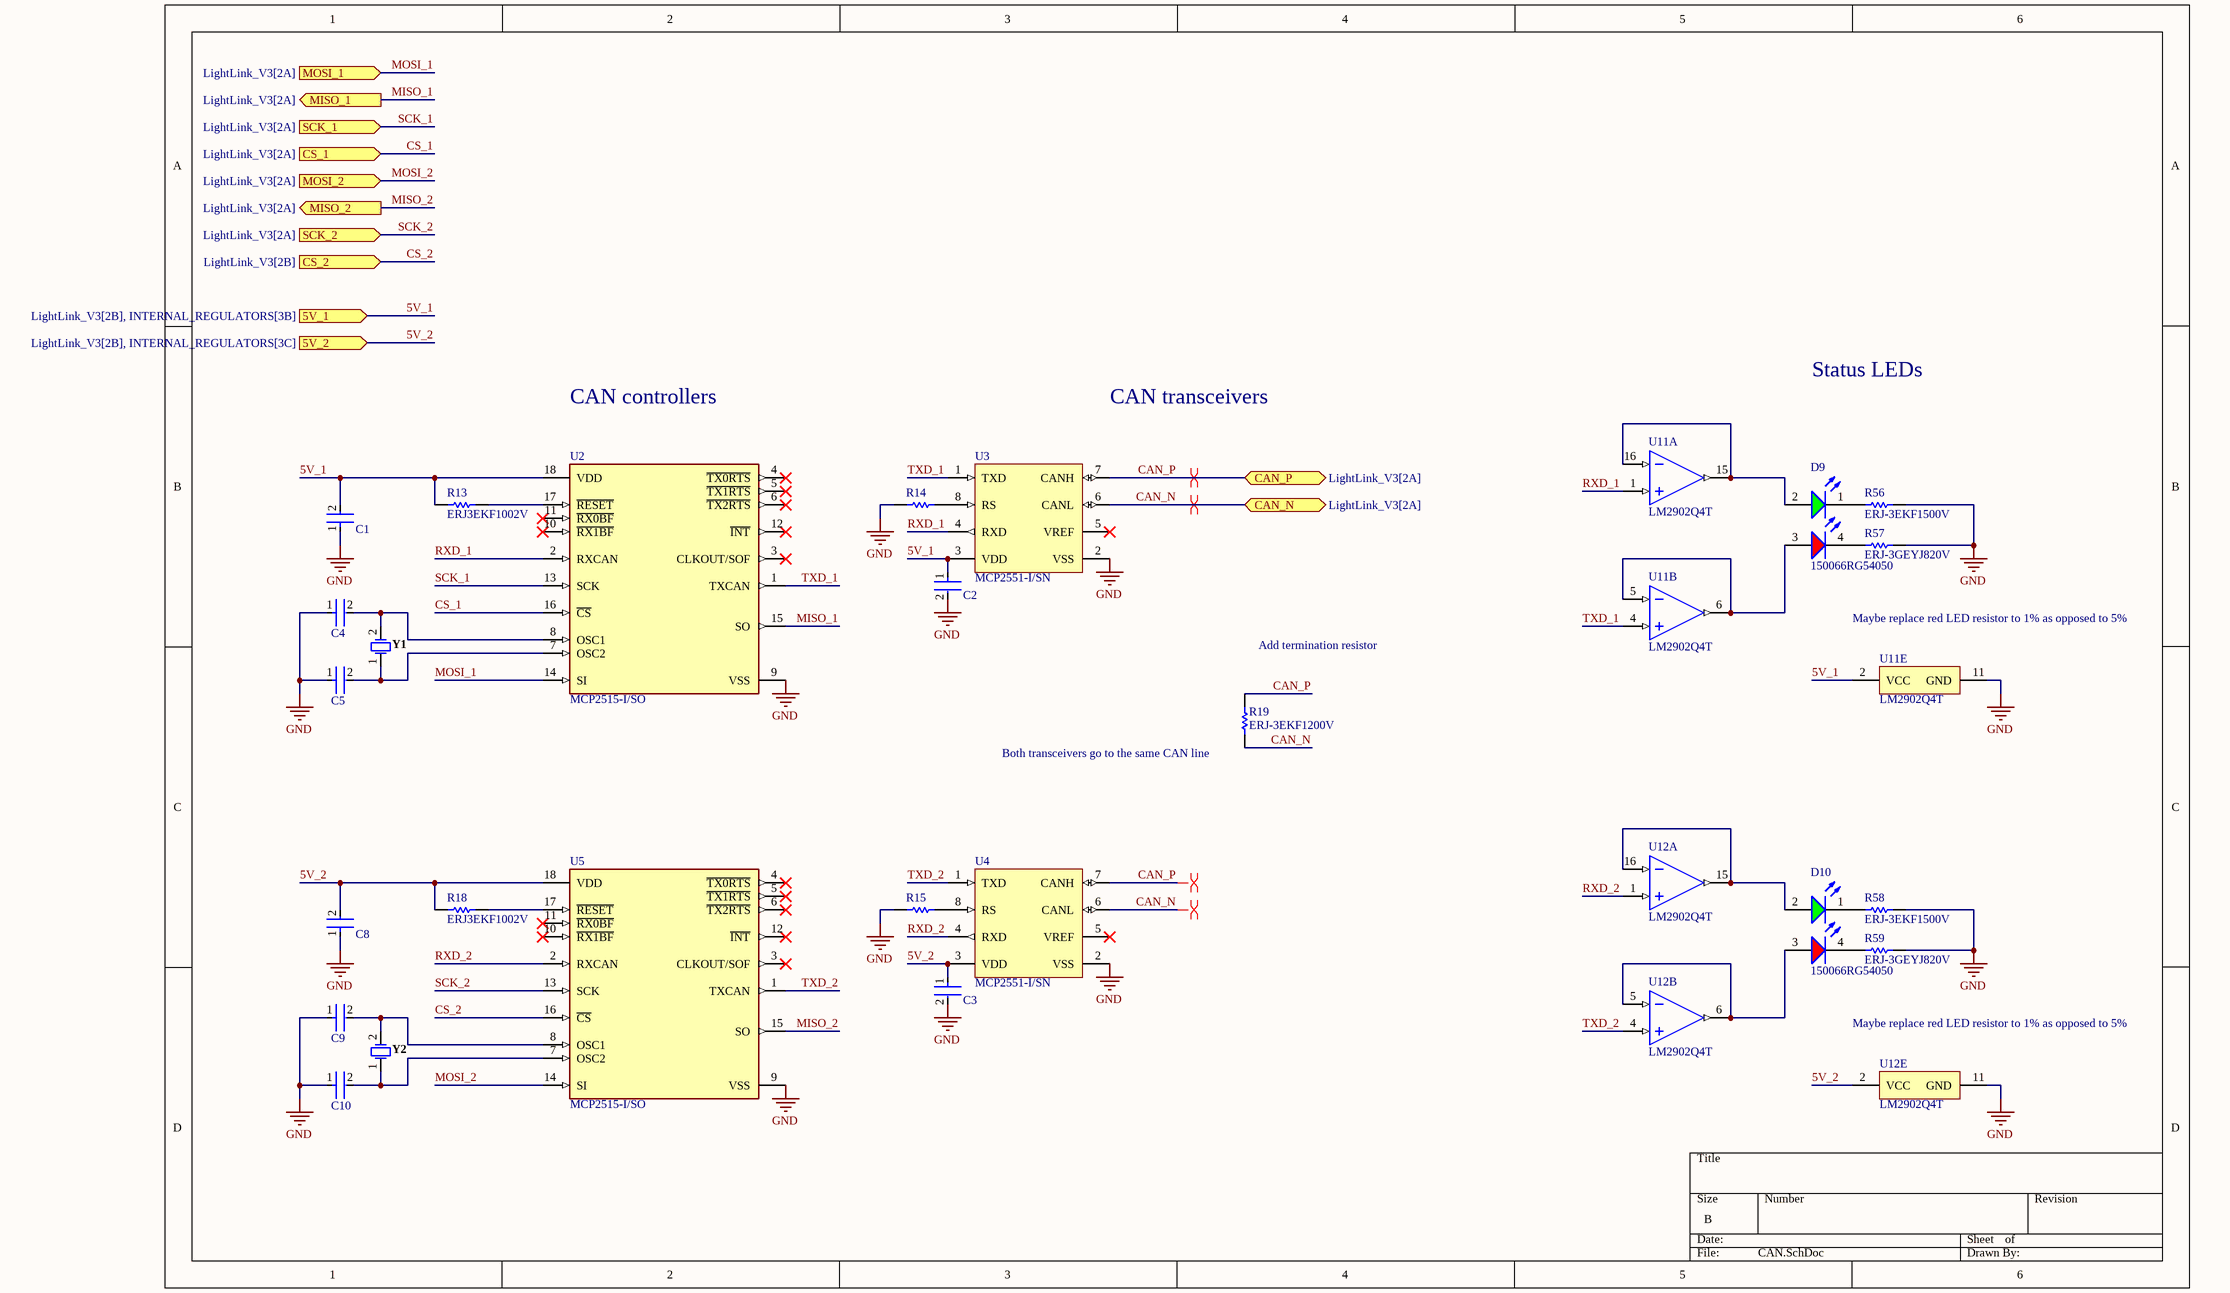
[diagram p2: CAN.SchDoc]

### Parts
C1  GRM188R60J106ME47D  [FP-GRM188-0_1-e0_2_0_55-IPC_A]  (value not drawn)
C2  C0402C104K8PACTU  [FP-C0402-BB-MFG]  (value not drawn)
C3  C0402C104K8PACTU  [FP-C0402-BB-MFG]  (value not drawn)
C4  GRM188R60J106ME47D  [FP-GRM188-0_1-e0_2_0_55-IPC_A]  (value not drawn)
C5  GRM188R60J106ME47D  [FP-GRM188-0_1-e0_2_0_55-IPC_A]  (value not drawn)
C8  GRM188R60J106ME47D  [FP-GRM188-0_1-e0_2_0_55-IPC_A]  (value not drawn)
C9  GRM188R60J106ME47D  [FP-GRM188-0_1-e0_2_0_55-IPC_A]  (value not drawn)
C10  GRM188R60J106ME47D  [FP-GRM188-0_1-e0_2_0_55-IPC_A]  (value not drawn)
D9  150066RG54050  [WL-SBCD_0606]
D10  150066RG54050  [WL-SBCD_0606]
R13  ERJ3EKF1002V  [RESC1609X55X30LL15T15]
R14  ERJ3EKF1002V  [RESC1609X55X30LL15T15]  (value not drawn)
R15  ERJ3EKF1002V  [RESC1609X55X30LL15T15]  (value not drawn)
R18  ERJ3EKF1002V  [RESC1609X55X30LL15T15]
R19  ERJ-3EKF1200V  [RESC1609X55X30ML15T15]
R56  ERJ-3EKF1500V  [RESC1608X55X30NL15T15]
R57  ERJ-3GEYJ820V  [RESC1608X55X30NL15T15]
R58  ERJ-3EKF1500V  [RESC1608X55X30NL15T15]
R59  ERJ-3GEYJ820V  [RESC1608X55X30NL15T15]
U2  MCP2515-I/SO  [FP-C04-051-MFG]
U3  MCP2551-I/SN  [MCHP-SN8_V]
U4  MCP2551-I/SN  [MCHP-SN8_V]
U5  MCP2515-I/SO  [FP-C04-051-MFG]
U11  LM2902Q4T  [LM2902Q4T-Footprint-1]  (parts A,B,E of 5)
U12  LM2902Q4T  [LM2902Q4T-Footprint-1]  (parts A,B,E of 5)
Y1  FOXSLF/160-20  [FOX-FOXSLF160-20]  (value not drawn)
Y2  FOXSLF/160-20  [FOX-FOXSLF160-20]  (value not drawn)

### Ports
5V_1 (in, see LightLink_V3[2B], INTERNAL_REGULATORS[3B]), 5V_2 (in, see LightLink_V3[2B], INTERNAL_REGULATORS[3C]), CAN_N (bidir, see LightLink_V3[2A]), CAN_P (bidir, see LightLink_V3[2A]), CS_1 (in, see LightLink_V3[2A]), CS_2 (in, see LightLink_V3[2B]), MISO_1 (out, see LightLink_V3[2A]), MISO_2 (out, see LightLink_V3[2A]), MOSI_1 (in, see LightLink_V3[2A]), MOSI_2 (in, see LightLink_V3[2A]), SCK_1 (in, see LightLink_V3[2A]), SCK_2 (in, see LightLink_V3[2A])

### Nets
GND: C1.1 C2.2 C3.2 C4.1 C5.1 C8.1 C9.1 C10.1 R14.1 R15.1 R56.2 R57.2 R58.2 R59.2 U2.9(VSS) U3.2(VSS) U4.2(VSS) U5.9(VSS) U11.11(GND) U12.11(GND)
5V_1: C1.2 C2.1 R13.1 U2.18(VDD) U3.3(VDD) U11.2(VCC) ; port 5V_1
5V_2: C3.1 C8.2 R18.1 U4.3(VDD) U5.18(VDD) U12.2(VCC) ; port 5V_2
CAN_N: R19.1 U3.6(CANL) U4.6(CANL) ; port CAN_N
CAN_P: R19.2 U3.7(CANH) U4.7(CANH) ; port CAN_P
CS_1: U2.16(~{CS}) ; port CS_1
CS_2: U5.16(~{CS}) ; port CS_2
MISO_1: U2.15(SO) ; port MISO_1
MISO_2: U5.15(SO) ; port MISO_2
MOSI_1: U2.14(SI) ; port MOSI_1
MOSI_2: U5.14(SI) ; port MOSI_2
RXD_1: U2.2(RXCAN) U3.4(RXD) U11.1(1IN+)
RXD_2: U4.4(RXD) U5.2(RXCAN) U12.1(1IN+)
SCK_1: U2.13(SCK) ; port SCK_1
SCK_2: U5.13(SCK) ; port SCK_2
TXD_1: U2.1(TXCAN) U3.1(TXD) U11.4(2IN+)
TXD_2: U4.1(TXD) U5.1(TXCAN) U12.4(2IN+)
NetC4_2: C4.2 U2.8(OSC1) Y1.2
NetC5_2: C5.2 U2.7(OSC2) Y1.1
NetC9_2: C9.2 U5.8(OSC1) Y2.2
NetC10_2: C10.2 U5.7(OSC2) Y2.1
NetD9_1: D9.1(K) R56.1
NetD9_2: D9.2(A) U11.15(1OUT) U11.16(1IN-)
NetD9_3: D9.3(A) U11.5(2IN-) U11.6(2OUT)
NetD9_4: D9.4(K) R57.1
NetD10_1: D10.1(K) R58.1
NetD10_2: D10.2(A) U12.15(1OUT) U12.16(1IN-)
NetD10_3: D10.3(A) U12.5(2IN-) U12.6(2OUT)
NetD10_4: D10.4(K) R59.1
NetR13_2: R13.2 U2.17(~{RESET})
NetR14_2: R14.2 U3.8(RS)
NetR15_2: R15.2 U4.8(RS)
NetR18_2: R18.2 U5.17(~{RESET})

Not connected (* = marked no-connect by the designer): U2 3(CLKOUT/SOF)* 4(~{TX0RTS})* 5(~{TX1RTS})* 6(~{TX2RTS})* 10(~{RX1BF})* 11(~{RX0BF})* 12(~{INT})*; U3 5(VREF)*; U4 5(VREF)*; U5 3(CLKOUT/SOF)* 4(~{TX0RTS})* 5(~{TX1RTS})* 6(~{TX2RTS})* 10(~{RX1BF})* 11(~{RX0BF})* 12(~{INT})*

### Layout directives
differential pair: CAN_N, CAN_P

### Notes on the sheet
- CAN controllers
- CAN transceivers
- Status LEDs
- Maybe replace red LED resistor to 1% as opposed to 5%
- Add termination resistor
- (near R19) Both transceivers go to the same CAN line

### Library data of the parts
C1 C4 C5 C8-C10 = CMP-2006-02792-2: Chip Multilayer Ceramic Capacitors for General Purpose, 0603, 10uF, X5R, 15%, 20%, 6.3V; Packaging: Tape and Reel; Voltage Rating (DC): 6.3V; Width: 0.031inch; Termination: SMD/SMT; Dielectric: X5R; Package Quantity: 4000; Voltage Rating: 6.3V; Capacitance: 10uF; Case/Package: 0603; Min Operating Temperature: -55°C; Voltage: 6.3V; Length: 1.6mm; Thickness: 0.035inch; Lead Free: Lead Free; Depth: 0.8mm; Case Code (Imperial): 0603; Max Operating Temperature: 85°C; Material: Ceramic; Height: 0.8mm; Tolerance: 20%; Mount: Surface Mount; REACH SVHC: No SVHC; Radiation Hardening: No; Case Code (Metric): 1608
C2 C3 = CMP-2008-02046-2: CAP CER 0.1UF 10V X5R 0402; Manufacturer: Kemet; Material: Ceramic; Capacitance: 0.10 μF; Temperature Coefficient: 15%; Tolerance: 0.1; Value: 0.10 μF; Package: C0402-BB; Temperature: -55°C to +125°C; ComponentLink2Description: Datasheet; Temperature Characteristic: X5R; Device Class L1: Passive Components; Height: 0.55mm; Lead Free: Yes; ComponentLink2URL: https://content.kemet.com/datasheets/KEM_C1002_X7R_SMD.pdf; Device Class L2: Capacitors; Temperature Range Low: -55°C; Temperature Range High: +125°C; RoHS: TRUE; Octopart: https://octopart.com/c0402c104k8pactu-kemet-140039; Automotive: No; Mouser Description: Capacitor 100 nF 10 VDC 0402; Category: Cap; Voltage Rating: 10 V; Digikey Description: CAP CER 0.1UF 10V X5R 0402; Ipc Land Pattern Name: CAPC10050X50; Device Class L3: Ceramic Capacitors; Manufacturer Part Number: C0402C104K8PACTU
D9 D10 = CMP-004-00034-2: as D11 on sheet MOSFET
R13-R15 R18 = CMP-1012-00623-3: as R11 on sheet LightLink_V3; Number of Pins: 2; Package Reference: 603; Depth: 0.8mm; Mount: SurfaceMount; Package Description: 2-Pin Surface Mount Device, Body 1.6 x 0.85 mm; Datasheet Version: 02/2017; Length: 1.6mm; Lead Free: LeadFree; Height: 0.45mm; Number of Terminations: 2; Max Power Dissipation: 100mW; Min Operating Temperature: -55degC; Datasheet URL: https://industrial.panasonic.com/cdbs/www-data/pdf/RDA0000/AOA0000C304.pdf; Termination: SMD/SMT; Case Code (Metric): 1608; Case Code (Imperial): 0603; Tolerance: 1%; Max Operating Temperature: 155degC; RoHSCompliant: true; Voltage Rating (DC): 75V; Radiation Hardening: No; Packaging: TapeandReel; Composition: ThickFilm; Mounting Technology: SurfaceMount; Manufacturer URL: http://www.panasonic.com/; Width: 0.031inch; REACH SVHC: NoSVHC; Contact Plating: Tin; Military Standard: Not; Package Quantity: 1
R19 = CMP-2000-00213-2: Chip Resistor, 120 Ohm, +/- 1%, 0.1 W, -55 to 155 degC, 0603 (1608 Metric), RoHS, Tape and Reel; Manufacturer: Panasonic; Power Rating: 100mW; Voltage Rating (DC): 75V; Resistance: 120Ohm; Temperature Coefficient: 100ppm/degreesC; Number of Terminations: 2; Military Standard: Not; Tolerance: 1%; Min Operating Temperature: -55degC; Packaging: TapeandReel; Lead Free: LeadFree; Max Operating Temperature: 155degC; Manufacturer URL: http://www.panasonic.com/; Case Code (Imperial): 0603; REACH SVHC: NoSVHC; Width: 0.031inch; Datasheet URL: https://industrial.panasonic.com/cdbs/www-data/pdf/RDA0000/AOA0000C283.pdf; RoHSCompliant: true; Max Power Dissipation: 100mW; Termination: SMD/SMT; Package Reference: 0603; Height: 0.022inch; Depth: 0.8mm; Package Description: 2-Pin Surface Mount Device, Body 1.6 x 0.85 mm; Contact Plating: Tin; Length: 1.6mm; Package URL: http://www.st.com/st-web-ui/static/active/en/resource/technical/document/datasheet/CD00001320.pdf; Radiation Hardening: No; Package Quantity: 1; Number of Pins: 2; Datasheet Version: 42095.0; Voltage Rating: 75V; Composition: ThickFilm; Case/Package: 0603; Mount: SurfaceMount; Case Code (Metric): 1608
R56 R58 = CMP-2000-00256-1: Manufacturer: Panasonic; Part Number: ERJ-3EKF1500V
R57 R59 = CMP-1012-00048-2: Manufacturer: Panasonic; Part Number: ERJ-3GEYJ820V
U2 U5 = CMP-0186-00133-3: IC CAN CONTROLLER W/SPI 18SOIC; Manufacturer: Microchip; Min Supply Voltage: 2.7V; Max Supply Voltage: 5.5V; Standoff Height: 0.1mm; Nominal Supply Current: 10mA; Interface: SPI,CAN; Lead Free: Yes; Digikey Description: IC CAN CONTROLLER W/SPI 18SOIC; Category: IC; RoHS: TRUE; Manufacturer Part Number: MCP2515-I/SO; ComponentLink2URL: http://ww1.microchip.com/downloads/en/DeviceDoc/MCP2515-Stand-Alone-CAN-Controller-with-SPI-20001801J.pdf; Mouser Description: CAN Interface IC W/ SPI Interface; Device Class L2: Interface ICs; Package: C04-051; Automotive: No; Function: Controller; Octopart: https://octopart.com/mcp2515-i%2Fso-microchip-430187; Temperature: -40°C to +85°C; Ipc Land Pattern Name: SOIC127P1030X265-18; Ambient Temperature Range Low: -65°C; Height: 2.65mm; Device Class L1: Integrated Circuits (ICs); Ambient Temperature Range High: +125°C; Footprint Url: http://ww1.microchip.com/downloads/en/DeviceDoc/18L_SOIC_Wide_7.50_SO_C04-0051D.pdf; Temperature Range Low: -40°C; Device Class L3: Controllers; Temperature Range High: +85°C; ComponentLink2Description: Datasheet
U3 U4 = CMP-0186-00138-3: High-Speed CAN Transceiver, / 1 Mb/s, 4.5 to 5.5 V, 8-Pin SOIC (SN), Industrial Temperature, RoHS, Tube; Manufacturer: Microchip; RoHSCompliant: true; PackageReference: SN8; ComponentLink1URL: http://www.microchip.com/; DatasheetVersion: Rev. F, 07/2010; ComponentLink2Description: Datasheet; ComponentLink2URL: http://ww1.microchip.com/downloads/en/DeviceDoc/21667f.pdf; ComponentLink3Description: Package Specification; PackageDescription: 8-Pin Small Outline Integrated Circuit, Body 4.9 x 3.9 mm, Pitch 1.27 mm; ComponentLink1Description: Manufacturer URL; Mounting Technology: Surface Mount; ComponentLink3URL: http://www.microchip.com/stellent/groups/techpub_sg/documents/packagingspec/en012702.pdf
U11 U12 = CMP-014-00004-1: LM2902 Series 30 V 1.3 MHz Low-Power Quad Operational Amplifier - QFN-16 (3x3)
Y1 Y2 = CMP-1749-00003-1: Resistance Weld Thru-Hole Crystal, 16 MHz, -20 to 70 degC, 2-Pin THD, RoHS, Bulk; Voltage Rating: 250 V; Tolerance: 1%; Resistance: 221 kohm; Case\Package: Axial; Power Rating: 250 mW; RoHSCompliant: true; Package Quantity: 200; Packaging: Bulk; Min Operating Temperature: -55 degC; DatasheetVersion: Mar-15; ComponentLink1URL: http://www.foxonline.com/; Max Operating Temperature: 155 degC; PackageReference: FOXSLF160-20; Mount: Through Hole; PackageDescription: 2-Pin Through Hole Device, Body 11.35 x 4.65 mm; ComponentLink1Description: Manufacturer URL; ComponentLink2URL: http://www.foxonline.com/pdfs/hc49slf.pdf; ComponentLink2Description: Datasheet; Length: 0.248 inch

## Sheet PWR_MGMT.SchDoc
size C; SheetNumber: 4; SheetTotal: 6
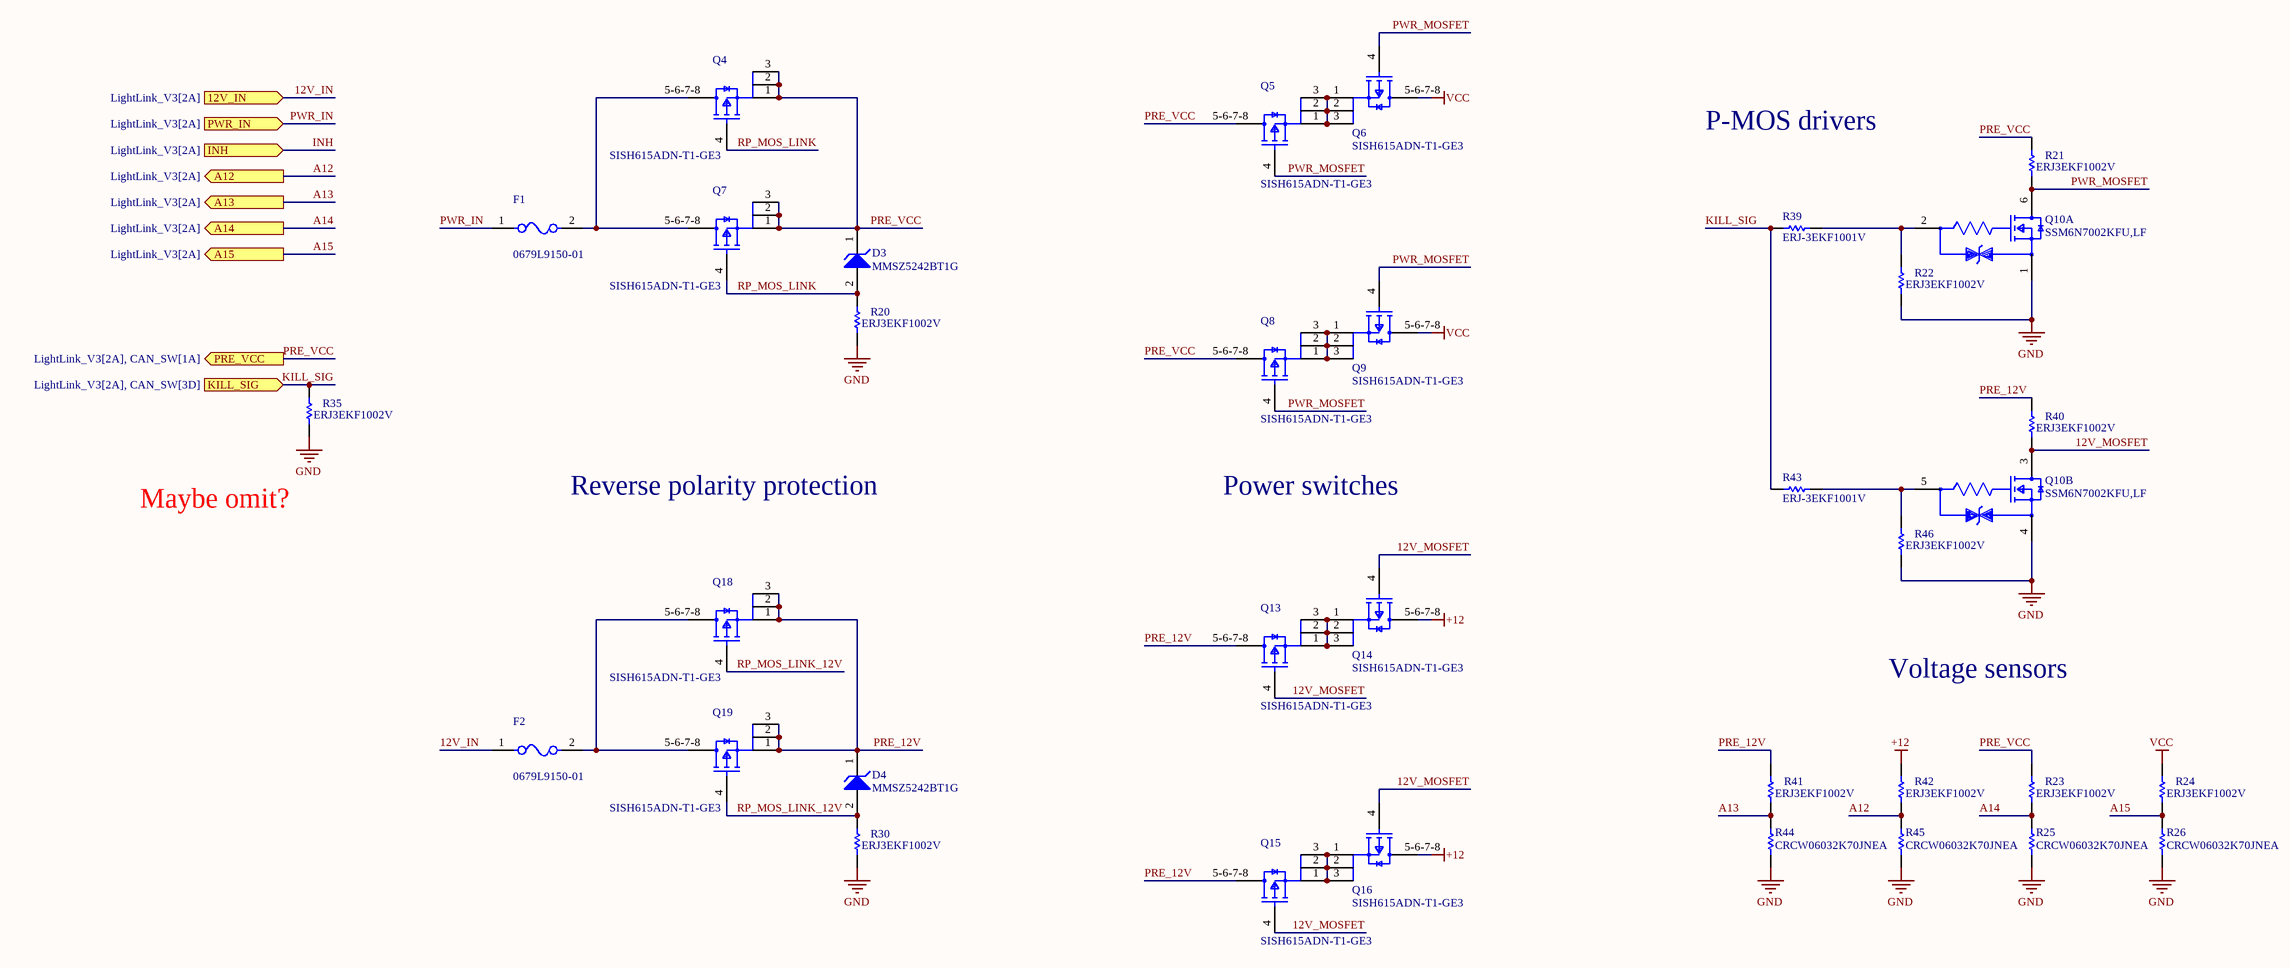
[diagram p3: PWR_MGMT.SchDoc]

### Parts
D3  MMSZ5242BT1G  [ONSC-SOD-123-2-425-04_V]
D4  MMSZ5242BT1G  [ONSC-SOD-123-2-425-04_V]
F1  0679L9150-01  [FP-0679L-MFG]
F2  0679L9150-01  [FP-0679L-MFG]
Q4  SISH615ADN-T1-GE3  [SISH615ADN-T1-GE3-Footprint-1]
Q5  SISH615ADN-T1-GE3  [SISH615ADN-T1-GE3-Footprint-1]
Q6  SISH615ADN-T1-GE3  [SISH615ADN-T1-GE3-Footprint-1]
Q7  SISH615ADN-T1-GE3  [SISH615ADN-T1-GE3-Footprint-1]
Q8  SISH615ADN-T1-GE3  [SISH615ADN-T1-GE3-Footprint-1]
Q9  SISH615ADN-T1-GE3  [SISH615ADN-T1-GE3-Footprint-1]
Q10  SSM6N7002KFU,LF  [FP-SSOP6-P-0_65A-MFG]  (parts A,B of 2)
Q13  SISH615ADN-T1-GE3  [SISH615ADN-T1-GE3-Footprint-1]
Q14  SISH615ADN-T1-GE3  [SISH615ADN-T1-GE3-Footprint-1]
Q15  SISH615ADN-T1-GE3  [SISH615ADN-T1-GE3-Footprint-1]
Q16  SISH615ADN-T1-GE3  [SISH615ADN-T1-GE3-Footprint-1]
Q18  SISH615ADN-T1-GE3  [SISH615ADN-T1-GE3-Footprint-1]
Q19  SISH615ADN-T1-GE3  [SISH615ADN-T1-GE3-Footprint-1]
R20  ERJ3EKF1002V  [RESC1609X55X30LL15T15]
R21  ERJ3EKF1002V  [RESC1609X55X30LL15T15]
R22  ERJ3EKF1002V  [RESC1609X55X30LL15T15]
R23  ERJ3EKF1002V  [RESC1609X55X30LL15T15]
R24  ERJ3EKF1002V  [RESC1609X55X30LL15T15]
R25  CRCW06032K70JNEA  [RESC1609X50X30ML10T20]
R26  CRCW06032K70JNEA  [RESC1609X50X30ML10T20]
R30  ERJ3EKF1002V  [RESC1609X55X30LL15T15]
R35  ERJ3EKF1002V  [RESC1609X55X30LL15T15]
R39  ERJ-3EKF1001V  [RESC1608X55X30LL15T15]
R40  ERJ3EKF1002V  [RESC1609X55X30LL15T15]
R41  ERJ3EKF1002V  [RESC1609X55X30LL15T15]
R42  ERJ3EKF1002V  [RESC1609X55X30LL15T15]
R43  ERJ-3EKF1001V  [RESC1608X55X30LL15T15]
R44  CRCW06032K70JNEA  [RESC1609X50X30ML10T20]
R45  CRCW06032K70JNEA  [RESC1609X50X30ML10T20]
R46  ERJ3EKF1002V  [RESC1609X55X30LL15T15]

### Ports
12V_IN (in, see LightLink_V3[2A]), A12 (out, see LightLink_V3[2A]), A13 (out, see LightLink_V3[2A]), A14 (out, see LightLink_V3[2A]), A15 (out, see LightLink_V3[2A]), INH (in, see LightLink_V3[2A]), KILL_SIG (in, see LightLink_V3[2A], CAN_SW[3D]), PRE_VCC (out, see LightLink_V3[2A], CAN_SW[1A]), PWR_IN (in, see LightLink_V3[2A])

### Nets
+12: Q14.5-6-7-8(D) Q16.5-6-7-8(D) R42.1
GND: Q10.1(Source1) Q10.4(Source2) R20.2 R22.2 R25.1 R26.1 R30.2 R35.2 R44.1 R45.1 R46.2
VCC: Q6.5-6-7-8(D) Q9.5-6-7-8(D) R24.1
12V_IN: F2.1 ; port 12V_IN
12V_MOSFET: Q10.3(Drain2) Q13.4(G) Q14.4(G) Q15.4(G) Q16.4(G) R40.2
A12: R42.2 R45.2 ; port A12
A13: R41.2 R44.2 ; port A13
A14: R23.2 R25.2 ; port A14
A15: R24.2 R26.2 ; port A15
INH: port INH
KILL_SIG: R35.1 R39.1 R43.1 ; port KILL_SIG
PRE_12V: D4.1(K) Q13.5-6-7-8(D) Q15.5-6-7-8(D) Q18.1(S) Q18.2(S) Q18.3(S) Q19.1(S) Q19.2(S) Q19.3(S) R40.1 R41.1
PRE_VCC: D3.1(K) Q4.1(S) Q4.2(S) Q4.3(S) Q5.5-6-7-8(D) Q7.1(S) Q7.2(S) Q7.3(S) Q8.5-6-7-8(D) R21.1 R23.1 ; port PRE_VCC
PWR_IN: F1.1 ; port PWR_IN
PWR_MOSFET: Q5.4(G) Q6.4(G) Q8.4(G) Q9.4(G) Q10.6(Drain1) R21.2
RP_MOS_LINK: D3.2(A) Q4.4(G) Q7.4(G) R20.1
RP_MOS_LINK_12V: D4.2(A) Q18.4(G) Q19.4(G) R30.1
NetF1_2: F1.2 Q4.5-6-7-8(D) Q7.5-6-7-8(D)
NetF2_2: F2.2 Q18.5-6-7-8(D) Q19.5-6-7-8(D)
NetQ5_1: Q5.1(S) Q5.2(S) Q5.3(S) Q6.1(S) Q6.2(S) Q6.3(S)
NetQ8_1: Q8.1(S) Q8.2(S) Q8.3(S) Q9.1(S) Q9.2(S) Q9.3(S)
NetQ10_2: Q10.2(Gate1) R22.1 R39.2
NetQ10_5: Q10.5(Gate2) R43.2 R46.1
NetQ13_1: Q13.1(S) Q13.2(S) Q13.3(S) Q14.1(S) Q14.2(S) Q14.3(S)
NetQ15_1: Q15.1(S) Q15.2(S) Q15.3(S) Q16.1(S) Q16.2(S) Q16.3(S)

### Notes on the sheet
- P-MOS drivers
- Maybe omit?
- Reverse polarity protection
- Power switches
- Voltage sensors

### Library data of the parts
D3 D4 = CMP-1060-00565-1: Zener Voltage Regulator, 500 mW, 2-Pin SOD-123, Pb-Free, Tape and Reel; Manufacturer: On Semiconductor; P Max (W): 0.5; VZ Typ (V): 12; PartNumber: MMSZ5242BT1G; PackageReference: SOD-123-2-425-04; ComponentLink3URL: http://www.onsemi.com/pub_link/Collateral/425-04.PDF; Mounting Technology: Surface Mount; ComponentLink2Description: Datasheet; ComponentLink1URL: http://www.onsemi.com/; ComponentLink3Description: Package Specification; PackageDescription: 2-Pin SOD, Body 1.6 x 2.69 mm; PackageVersion: Rev. G, 10/2009; ComponentLink1Description: Manufacturer URL; RoHS: Pb-Free; ComponentLink2URL: http://www.onsemi.com/pub_link/Collateral/MMSZ5221BT1-D.PDF; Packing: Tape and Reel; DatasheetVersion: Rev. 12
F1 F2 = CMP-16042-000002-1: FUSE BRD MNT 15A 125VAC/VDC; Manufacturer: Bel Fuse; Max Fuse Ac Voltage: 125V; Fuse Blow Speed: Fast; Fuse I2T: 103.5A2Sec; Fuse Interrupt Ac Current: 50A; Automotive Grade: Grade 1; Value: 0.0038Ω; Fuse Interrupt Dc Current: 300A; Fuse Voltage Drop: 0.13V; Device Class L2: Fuses; ComponentLink2URL: https://www.belfuse.com/resources/CircuitProtection/datasheets/0679L%20Sep2016.pdf; Package: 0679L; Height: 2.79mm; Digikey Description: FUSE BRD MNT 15A 125VAC/VDC; Temperature Range High: +125°C; Device Class L3: unset; Octopart: https://octopart.com/0679l9150-01-bel+fuse-70850665; Temperature Range Low: -55°C; Fuse Current: 15A; Max Fuse Dc Voltage: 125V; Ipc Land Pattern Name: CAPC610254X254; Manufacturer Part Number: 0679L9150-01; Category: Fuse; Lead Free: Yes; Automotive: Yes; Resistance: 0.0038Ω; RoHS: TRUE; Device Class L1: Circuit Protection; ComponentLink2Description: Datasheet; Temperature: -55°C to +125°C; Voltage Rating: 125V
Q4-Q9 Q13-Q16 Q18 Q19 = CMP-013-00036-2: as Q1 on sheet MOSFET
Q10 = CMP-35916-000009-1: as Q11#1 on sheet LightLink_V3; Mount: Surface Mount; Drain to Source Voltage (Vdss): 60V; Packaging: Tape and Reel
R20-R24 R30 R35 R40-R42 R46 = CMP-1012-00623-3: as R11 on sheet LightLink_V3; Number of Pins: 2; Package Reference: 603; Depth: 0.8mm; Mount: SurfaceMount; Package Description: 2-Pin Surface Mount Device, Body 1.6 x 0.85 mm; Datasheet Version: 02/2017; Length: 1.6mm; Lead Free: LeadFree; Height: 0.45mm; Number of Terminations: 2; Max Power Dissipation: 100mW; Min Operating Temperature: -55degC; Datasheet URL: https://industrial.panasonic.com/cdbs/www-data/pdf/RDA0000/AOA0000C304.pdf; Termination: SMD/SMT; Case Code (Metric): 1608; Case Code (Imperial): 0603; Tolerance: 1%; Max Operating Temperature: 155degC; RoHSCompliant: true; Voltage Rating (DC): 75V; Radiation Hardening: No; Packaging: TapeandReel; Composition: ThickFilm; Mounting Technology: SurfaceMount; Manufacturer URL: http://www.panasonic.com/; Width: 0.031inch; REACH SVHC: NoSVHC; Contact Plating: Tin; Military Standard: Not; Package Quantity: 1
R25 R26 R44 R45 = CMP-2000-03183-1: Manufacturer: Vishay Dale; Part Number: CRCW06032K70JNEA
R39 R43 = CMP-2000-00180-1: Manufacturer: Panasonic; Part Number: ERJ-3EKF1001V

## Sheet INTERNAL_REGULATORS.SchDoc
size B; SheetNumber: 5; SheetTotal: 5
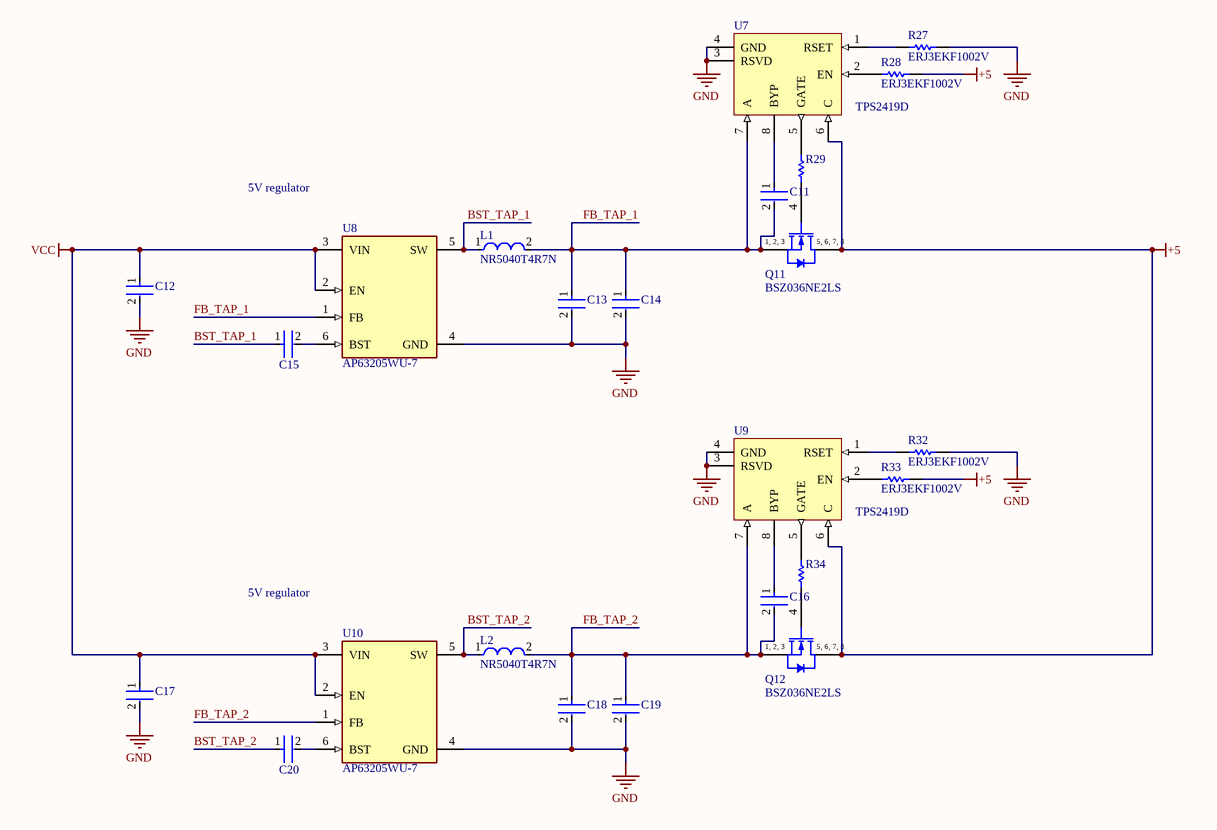
[diagram p4: INTERNAL_REGULATORS.SchDoc]

### Parts
(Parts that share a designator on the sheet are numbered #1, #2 ... from top to bottom, then left to right.)
C11  08055C222JAT2A  [FP-0805-L_2_01_0_2-W_1_25-IPC_C]  (value not drawn)
C12  C0805C106K8PACTU  [FP-C0805C-DG-MFG]  (value not drawn)
C13  GRM21BR61E226ME44L  [FP-GRM21B-0_2-e0_2_0_7-IPC_B]  (value not drawn)
C14  GRM21BR61E226ME44L  [FP-GRM21B-0_2-e0_2_0_7-IPC_B]  (value not drawn)
C15  C0402C104K8PACTU  [FP-C0402-BB-MFG]  (value not drawn)
C16  08055C222JAT2A  [FP-0805-L_2_01_0_2-W_1_25-IPC_C]  (value not drawn)
C17  C0805C106K8PACTU  [FP-C0805C-DG-MFG]  (value not drawn)
C18  GRM21BR61E226ME44L  [FP-GRM21B-0_2-e0_2_0_7-IPC_B]  (value not drawn)
C19  GRM21BR61E226ME44L  [FP-GRM21B-0_2-e0_2_0_7-IPC_B]  (value not drawn)
C20  C0402C104K8PACTU  [FP-C0402-BB-MFG]  (value not drawn)
L1  NR5040T4R7N  [FP-NR5040-H_4_1-MFG]
L2  NR5040T4R7N  [FP-NR5040-H_4_1-MFG]
Q11#2  BSZ036NE2LS  [INF-PG-TSDSON-8_FL_V]
Q12  BSZ036NE2LS  [INF-PG-TSDSON-8_FL_V]
R27#1  ERJ3EKF1002V  [RESC1609X55X30LL15T15]
R28#1  ERJ3EKF1002V  [RESC1609X55X30LL15T15]
R29#1  ERJ3EKF51R0V  [RESC1608X55X30NL15T15]  (value not drawn)
R32#1  ERJ3EKF1002V  [RESC1609X55X30LL15T15]
R33#1  ERJ3EKF1002V  [RESC1609X55X30LL15T15]
R34#1  ERJ3EKF51R0V  [RESC1608X55X30NL15T15]  (value not drawn)
U7#1  TPS2419D  [D0008A_N]
U8  AP63205WU-7  [FP-TSOT26-MFG]
U9  TPS2419D  [D0008A_N]
U10  AP63205WU-7  [FP-TSOT26-MFG]

### Nets
+5: Q11#2.5(DRAIN) Q11#2.6(DRAIN) Q11#2.7(DRAIN) Q11#2.8(DRAIN) Q12.5(DRAIN) Q12.6(DRAIN) Q12.7(DRAIN) Q12.8(DRAIN) R28#1.1 R33#1.1 U7#1.6(C) U9.6(C)
GND: C12.2 C13.2 C14.2 C17.2 C18.2 C19.2 R27#1.1 R32#1.1 U7#1.3(RSVD) U7#1.4(GND) U8.4(GND) U9.3(RSVD) U9.4(GND) U10.4(GND)
VCC: C12.1 C17.1 U8.2(EN) U8.3(VIN) U10.2(EN) U10.3(VIN)
BST_TAP_1: C15.1 L1.1 U8.5(SW)
BST_TAP_2: C20.1 L2.1 U10.5(SW)
FB_TAP_1: C11.2 C13.1 C14.1 L1.2 Q11#2.1(SOURCE) Q11#2.2(SOURCE) Q11#2.3(SOURCE) U7#1.7(A) U8.1(FB)
FB_TAP_2: C16.2 C18.1 C19.1 L2.2 Q12.1(SOURCE) Q12.2(SOURCE) Q12.3(SOURCE) U9.7(A) U10.1(FB)
NetC11_1: C11.1 U7#1.8(BYP)
NetC15_2: C15.2 U8.6(BST)
NetC16_1: C16.1 U9.8(BYP)
NetC20_2: C20.2 U10.6(BST)
NetQ11#2_4: Q11#2.4(GATE) R29#1.1
NetQ12_4: Q12.4(GATE) R34#1.1
NetR27#1_2: R27#1.2 U7#1.1(RSET)
NetR28#1_2: R28#1.2 U7#1.2(EN)
NetR29#1_2: R29#1.2 U7#1.5(GATE)
NetR32#1_2: R32#1.2 U9.1(RSET)
NetR33#1_2: R33#1.2 U9.2(EN)
NetR34#1_2: R34#1.2 U9.5(GATE)

### Notes on the sheet
- 5V regulator
- (in symbol CMP-1090-00125-1) 1, 2, 3; 5, 6, 7, 8

### Library data of the parts
C11 C16 = CMP-2007-04392-2: General Purpose Ceramic Capacitor, 0805, 2.2nF, 5%, X7R, 0.15, 50V; Min Operating Temperature: -55°C; Max Operating Temperature: 125°C; Construction: Flat; Voltage Rating (DC): 50V; Series: -; Case Code (Imperial): 0805; Width: 0.049inch; Mount: Surface Mount; Package Quantity: 4000; Packaging: Tape and Reel; Termination: SMD/SMT; Tolerance: 5%; Number of Pins: 2; Depth: 1.25mm; Lead Free: Lead Free; REACH SVHC: No SVHC; Contact Plating: Tin; Length: 2.01mm; Radiation Hardening: No; Capacitance: 2.2nF; Lead Pitch: 5.08mm; Thickness: 0.037inch; Dielectric: X7R; RoHS Compliant: Yes; Voltage Rating: 50V; Case Code (Metric): 2012; Height: 0.94mm; Case/Package: 0805
C12 C17 = CMP-2007-03243-2: CAP CER 10UF 10V X5R 0805; Manufacturer: Kemet; 3DS Part Number: 220-00001; Tolerance: 10%; Temperature Coefficient: 15%; Material: Ceramic; Device Class L2: Capacitors; Device Class L1: Passive Components; ComponentLink2URL: https://content.kemet.com/datasheets/KEM_C1006_X5R_SMD.pdf; Height: 1.4mm; Lead Free: Yes; Manufacturer Part Number: C0805C106K8PACTU; Digikey Description: CAP CER 10UF 10V X5R 0805; Octopart: https://octopart.com/c0805c106k8pactu-kemet-98697; Capacitance: 10uF; Value: 10uF; Temperature Range Low: -55°C; Temperature: -55°C to +85°C; Automotive: No; Mouser Description: CAP CER 10UF 10V X5R 0805; Ipc Land Pattern Name: CAPC200125X125; Temperature Range High: +85°C; Voltage: 10V; RoHS: TRUE; Device Class L3: Ceramic Capacitors; ComponentLink2Description: Datasheet; Voltage Rating: 10V; Package: C0805C-DG; Temperature Characteristic: X5R; Category: Cap
C13 C14 C18 C19 = CMP-2007-03222-3: Chip Multilayer Ceramic Capacitors for General Purpose, 0805, 22uF, X5R, 15%, 20%, 25V; Case/Package: 0805; Depth: 1.25mm; Resistor Type: Ceramic; Voltage Rating: 25V; Lead Free: Lead Free; Voltage Rating (DC): 25V; Case Code (Metric): 2012; Thickness: 0.057inch; REACH SVHC: No SVHC; Material: Ceramic; Tolerance: 20%; Length: 2mm; Capacitance: 22uF; Case Code (Imperial): 0805; Max Operating Temperature: 85°C; Termination: SMD/SMT; Weight: 0.000335oz; Dielectric: X5R; Packaging: Tape and Reel; Voltage: 25V; Package Quantity: 3000; Height: 1.25mm; Mount: Surface Mount; Width: 1.25mm; Min Operating Temperature: -55°C
C15 C20 = CMP-2008-02046-2: as C2 on sheet CAN; Package: C0402-BB; Temperature: -55°C to +125°C; ComponentLink2Description: Datasheet; Temperature Characteristic: X5R; Device Class L1: Passive Components; Height: 0.55mm; Lead Free: Yes; ComponentLink2URL: https://content.kemet.com/datasheets/KEM_C1002_X7R_SMD.pdf; Device Class L2: Capacitors; Temperature Range Low: -55°C; Temperature Range High: +125°C; RoHS: TRUE; Octopart: https://octopart.com/c0402c104k8pactu-kemet-140039; Automotive: No; Mouser Description: Capacitor 100 nF 10 VDC 0402; Category: Cap; Voltage Rating: 10 V; Digikey Description: CAP CER 0.1UF 10V X5R 0402; Ipc Land Pattern Name: CAPC10050X50; Device Class L3: Ceramic Capacitors; Manufacturer Part Number: C0402C104K8PACTU
L1 L2 = CMP-14484-001014-1: SMD Power Inductors 4.7uH ±30% 3.1A 37.7mΩ; Test Frequency: 100kHz; Self Resonant Frequency: 28MHz; DC Resistance (DCR): 37.7mR; Saturation Current: 3.3A; Shielding: Shielded; Core Material: Ferrite; Package Quantity: 1500; RoHS Compliant: Yes; Resistor Type: Wirewound; Width: 4.9mm; Termination: SMD/SMT; Number of Pins: 2; Current Rating: 3.1A; Depth: 5.1mm; RMS Current (Irms): 3.1A; Height - Seated (Max): 0.161inch; Height: 4mm; Packaging: Tape and Reel; Inductance: 4.7uH; Length: 0.193inch; Max DC Current: 3.3A; Inductance Tolerance: 30%; Case/Package: Nonstandard; Series: NR; Min Operating Temperature: -25°C; Max Operating Temperature: 120°C; Mount: Surface Mount; Radiation Hardening: No; Tolerance: 30%; Halogen Free: Halogen Free
Q11#2 Q12 = CMP-1090-00125-1: N-Channel OptiMOS Power-MOSFET, 25 V VDS, 40 A ID, -55 to 150 degC, PG-TSDSON-8, Reel, Green; Manufacturer: Infineon; Green: TRUE; VGS(th) (min): 1.2Â V; IDpuls (max): 160Â A; Rth: 3.4Â K/W; QG: 16Â nC; RDS (on) (max) (@4.5V): 5.1Â mOhm; VDS (max): 25Â V; ID (max): 40Â A; Ptot (max): 37Â W; RDS (on) (max): 3.6Â mOhm; VGS(th) (max): 2Â V; RthJA (max): 60 K/W; Polarity: N; Mounting Technology: Surface Mount; DatasheetVersion: Rev. 2.1; ComponentLink1Description: Manufacturer URL; ComponentLink1URL: http://www.infineon.com/; Halogen-free: TRUE; Packing: Reel; PartNumber: BSZ036NE2LS; PackageReference: PG-TSDSON-8; ComponentLink2Description: Datasheet; ComponentLink3URL: http://www.infineon.com/dgdl/DS_BSZ023N04LS_2_0_N.T..pdf?folderId=db3a304313b8b5a60113cee8763b02d7&fileId=db3a3043353fdc160135530f51f54823; PackageVersion: Rev. 02, 12/2010; PackageDescription: 8-Pin Plastic (Green) Thin Dual Small Outline Non-Leaded Package, 3.3 x 3.3 mm Body, 0.65 mm Pitch; RthJC (max): 3.4Â K/W; ComponentLink3Description: Package Specification; ComponentLink2URL: http://www.infineon.com/dgdl/BSZ036NE2LS_Rev+2.1.pdf?folderId=db3a304313b8b5a60113cee8763b02d7&fileId=db3a30432ea425a4012ed92706043869
R27#1 R28#1 R32#1 R33#1 = CMP-1012-00623-3: as R11 on sheet LightLink_V3; Number of Pins: 2; Package Reference: 603; Depth: 0.8mm; Mount: SurfaceMount; Package Description: 2-Pin Surface Mount Device, Body 1.6 x 0.85 mm; Datasheet Version: 02/2017; Length: 1.6mm; Lead Free: LeadFree; Height: 0.45mm; Number of Terminations: 2; Max Power Dissipation: 100mW; Min Operating Temperature: -55degC; Datasheet URL: https://industrial.panasonic.com/cdbs/www-data/pdf/RDA0000/AOA0000C304.pdf; Termination: SMD/SMT; Case Code (Metric): 1608; Case Code (Imperial): 0603; Tolerance: 1%; Max Operating Temperature: 155degC; RoHSCompliant: true; Voltage Rating (DC): 75V; Radiation Hardening: No; Packaging: TapeandReel; Composition: ThickFilm; Mounting Technology: SurfaceMount; Manufacturer URL: http://www.panasonic.com/; Width: 0.031inch; REACH SVHC: NoSVHC; Contact Plating: Tin; Military Standard: Not; Package Quantity: 1
R29#1 R34#1 = CMP-2000-00547-1: Manufacturer: Panasonic; Part Number: ERJ3EKF51R0V
U7#1 U9 = CMP-0334-00028-2: N+1 and ORing Power Rail Controller with Enable, 0.8 to 16.5 V, -40 to 85 degC, 8-pin SOIC (D), Green (RoHS & no Sb/Br); Manufacturer: Texas Instruments; Vin(Min)(V): 0.8; Enable (OV): Yes; Gate Control: on/off; No. of Outputs: 1; Vin(Max)(V): 16.5; Mounting Technology: Surface Mount; DatasheetVersion: SLVS998B; ComponentLink1URL: http://www.ti.com/general/docs/lit/getliterature.tsp?genericPartNumber=TPS2419&fileType=pdf; Code_JEDEC: MS-012AA; PackageReference: D0008A; Fault and Status: No; Under/Over Voltage Reporting: No; PackageVersion: revM, Jun-2011; Input Filter: No; PartNumber: TPS2419D; ComponentLink1Description: Datasheet; PackageDescription: 8-Pin Plastic Small Outline Integrated Circuit, 4.9 x 3.9 mm, Pitch 1.27 mm Pitch; Eco-Plan: Green (RoHS & no Sb/Br)
U8 U10 = CMP-12757-000001-1: IC REG BUCK 5V 2A TSOT26; Manufacturer: Diodes Inc.; Max Junction Temp: +160°C; Max Duty Cycle: 100%; Standoff Height: 0.01mm; Max Supply Voltage: 32V; Number Of Outputs: 1; Min Supply Voltage: 3.8V; Output Type: Fixed; Switching Frequency: 1100kHz; Nominal Supply Current: 22uA; Automotive: No; RoHS: TRUE; Switching Topology: Buck; Temperature: -40°C to +85°C; Footprint Url: https://www.diodes.com/assets/Package-Files/TSOT26.pdf; Lead Free: Yes; Digikey Description: IC REG BUCK 5V 2A TSOT26; Device Class L3: Voltage Regulators - Switching; Ambient Temperature Range High: +85°C; Category: IC; Package: TSOT26; Output Voltage: 5V; Output Current: 2A; ComponentLink2Description: Datasheet; Device Class L2: Power Management ICs; Ambient Temperature Range Low: -40°C; Temperature Range High: +85°C; Temperature Range Low: -40°C; Octopart: https://octopart.com/ap63205wu-7-diodes+inc.-98099551; Manufacturer Part Number: AP63205WU-7; Height: 1mm; Device Class L1: Integrated Circuits (ICs); ComponentLink2URL: https://www.diodes.com/assets/Datasheets/AP63200-AP63201-AP63203-AP63205.pdf